# EasyEDA Pro project Selectric Terminal.epro

# Schematic Schematic1
Create Date: 2024-04-24; Page Name: P1; Project Name: Selectric Conversion; Schematic Name: Schematic1; Update Date: 2024-07-01; Company: EasyEDA.com; Drawn: EasyEDA; Page Size: A4; Part Number: JLCPCB-002; Reviewed: EasyEDA; Version: V0.1
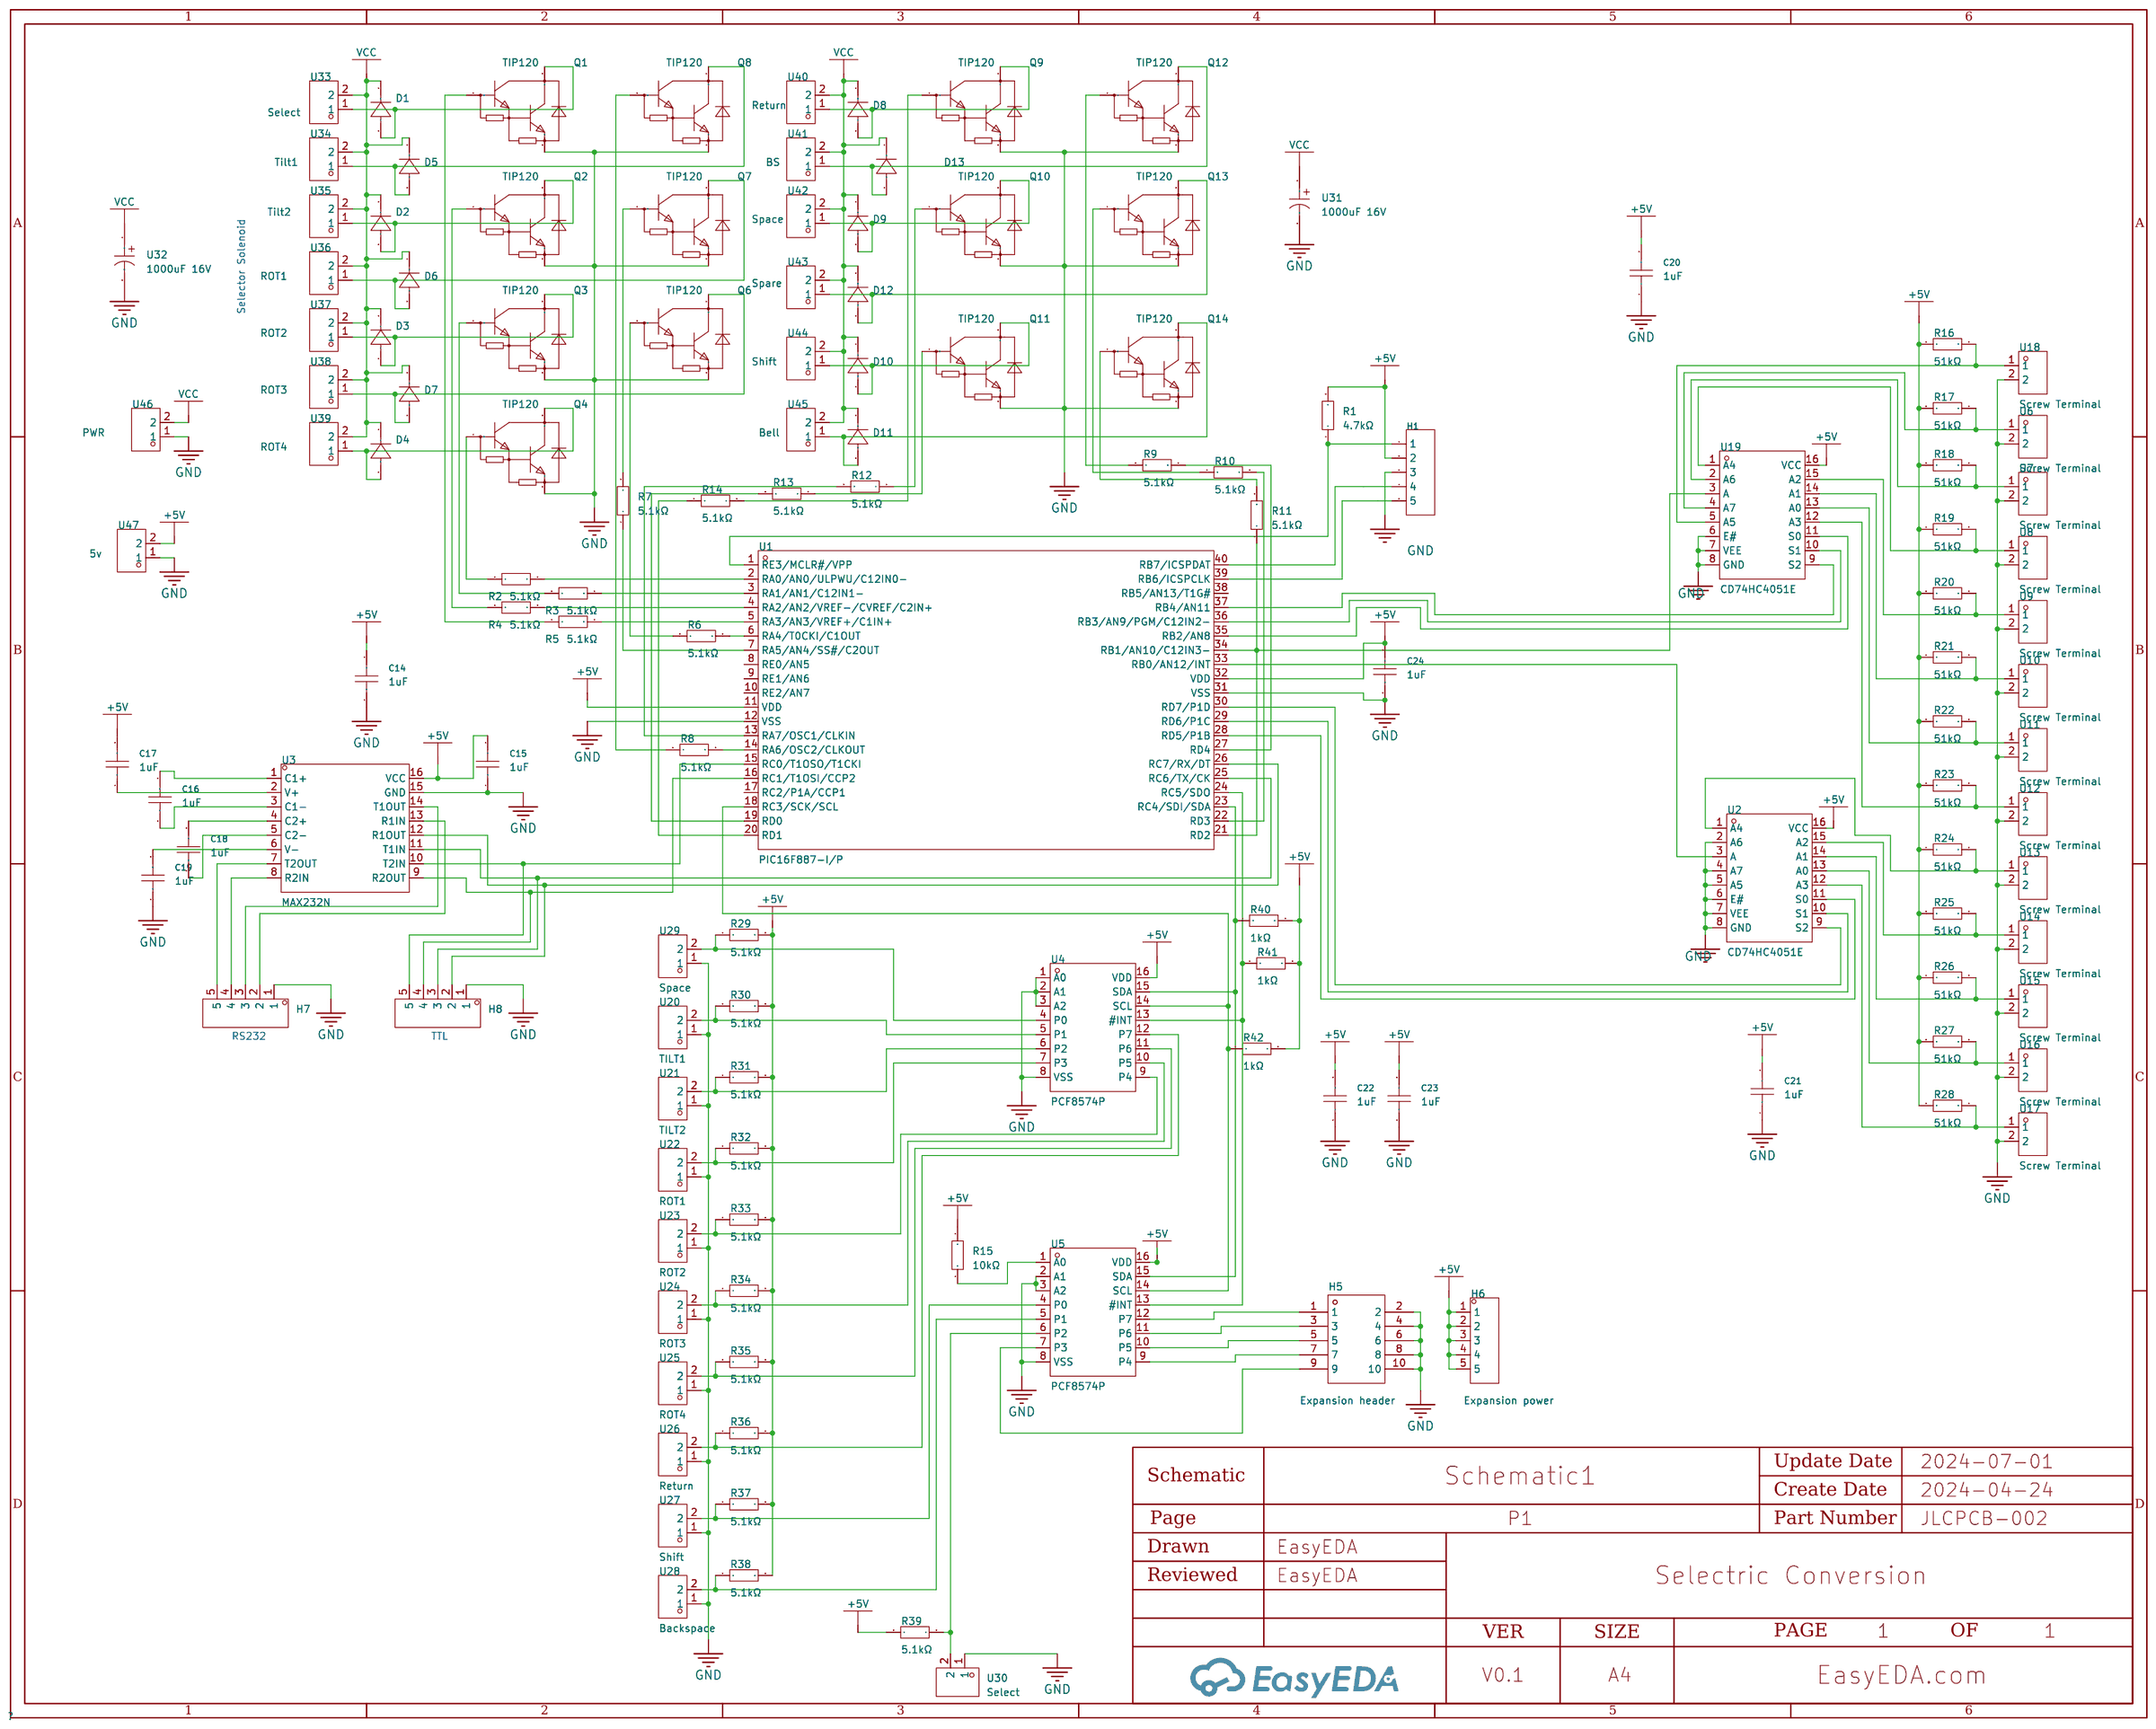
[diagram p0: schematic sheet]

## Parts
C14  1uF  [CAP-TH_L5.0-W2.5-P5.00-D1.0]
C15  1uF  [CAP-TH_L5.0-W2.5-P5.00-D1.0]
C16  1uF  [CAP-TH_L5.0-W2.5-P5.00-D1.0]
C17  1uF  [CAP-TH_L5.0-W2.5-P5.00-D1.0]
C18  1uF  [CAP-TH_L5.0-W2.5-P5.00-D1.0]
C19  1uF  [CAP-TH_L5.0-W2.5-P5.00-D1.0]
C20  1uF  [CAP-TH_L5.0-W2.5-P5.00-D1.0]
C21  1uF  [CAP-TH_L5.0-W2.5-P5.00-D1.0]
C22  1uF  [CAP-TH_L5.0-W2.5-P5.00-D1.0]
C23  1uF  [CAP-TH_L5.0-W2.5-P5.00-D1.0]
C24  1uF  [CAP-TH_L5.0-W2.5-P5.00-D1.0]
D1  -  [DO-41_BD2.4-L4.7-P8.70-D0.9-RD]
D2  -  [DO-41_BD2.4-L4.7-P8.70-D0.9-RD]
D3  -  [DO-41_BD2.4-L4.7-P8.70-D0.9-RD]
D4  -  [DO-41_BD2.4-L4.7-P8.70-D0.9-RD]
D5  -  [DO-41_BD2.4-L4.7-P8.70-D0.9-RD]
D6  -  [DO-41_BD2.4-L4.7-P8.70-D0.9-RD]
D7  -  [DO-41_BD2.4-L4.7-P8.70-D0.9-RD]
D8  -  [DO-41_BD2.4-L4.7-P8.70-D0.9-RD]
D9  -  [DO-41_BD2.4-L4.7-P8.70-D0.9-RD]
D10  -  [DO-41_BD2.4-L4.7-P8.70-D0.9-RD]
D11  -  [DO-41_BD2.4-L4.7-P8.70-D0.9-RD]
D12  -  [DO-41_BD2.4-L4.7-P8.70-D0.9-RD]
D13  -  [DO-41_BD2.4-L4.7-P8.70-D0.9-RD]
H1  -  [HDR-TH_5P-P2.54-V-F]
H5  Expansion header  [HDR-TH_10P-P2.54-V-M-R2-C5-S2.54]
H6  Expansion power  [HDR-TH_5P-P2.54-V-M]
H7  -  [HDR-TH_5P-P2.54-V-M]
H8  -  [HDR-TH_5P-P2.54-V-M]
Q1  TIP120  [TO-220-3_L10.0-W4.5-P2.54-L]
Q2  TIP120  [TO-220-3_L10.0-W4.5-P2.54-L]
Q3  TIP120  [TO-220-3_L10.0-W4.5-P2.54-L]
Q4  TIP120  [TO-220-3_L10.0-W4.5-P2.54-L]
Q6  TIP120  [TO-220-3_L10.0-W4.5-P2.54-L]
Q7  TIP120  [TO-220-3_L10.0-W4.5-P2.54-L]
Q8  TIP120  [TO-220-3_L10.0-W4.5-P2.54-L]
Q9  TIP120  [TO-220-3_L10.0-W4.5-P2.54-L]
Q10  TIP120  [TO-220-3_L10.0-W4.5-P2.54-L]
Q11  TIP120  [TO-220-3_L10.0-W4.5-P2.54-L]
Q12  TIP120  [TO-220-3_L10.0-W4.5-P2.54-L]
Q13  TIP120  [TO-220-3_L10.0-W4.5-P2.54-L]
Q14  TIP120  [TO-220-3_L10.0-W4.5-P2.54-L]
R1  4.7kΩ  [R_AXIAL-0.4]
R2  5.1kΩ  [R_AXIAL-0.4]
R3  5.1kΩ  [R_AXIAL-0.4]
R4  5.1kΩ  [R_AXIAL-0.4]
R5  5.1kΩ  [R_AXIAL-0.4]
R6  5.1kΩ  [R_AXIAL-0.4]
R7  5.1kΩ  [R_AXIAL-0.4]
R8  5.1kΩ  [R_AXIAL-0.4]
R9  5.1kΩ  [R_AXIAL-0.4]
R10  5.1kΩ  [R_AXIAL-0.4]
R11  5.1kΩ  [R_AXIAL-0.4]
R12  5.1kΩ  [R_AXIAL-0.4]
R13  5.1kΩ  [R_AXIAL-0.4]
R14  5.1kΩ  [R_AXIAL-0.4]
R15  10kΩ  [R_AXIAL-0.4]
R16  51kΩ  [R_AXIAL-0.4]
R17  51kΩ  [R_AXIAL-0.4]
R18  51kΩ  [R_AXIAL-0.4]
R19  51kΩ  [R_AXIAL-0.4]
R20  51kΩ  [R_AXIAL-0.4]
R21  51kΩ  [R_AXIAL-0.4]
R22  51kΩ  [R_AXIAL-0.4]
R23  51kΩ  [R_AXIAL-0.4]
R24  51kΩ  [R_AXIAL-0.4]
R25  51kΩ  [R_AXIAL-0.4]
R26  51kΩ  [R_AXIAL-0.4]
R27  51kΩ  [R_AXIAL-0.4]
R28  51kΩ  [R_AXIAL-0.4]
R29  5.1kΩ  [R_AXIAL-0.4]
R30  5.1kΩ  [R_AXIAL-0.4]
R31  5.1kΩ  [R_AXIAL-0.4]
R32  5.1kΩ  [R_AXIAL-0.4]
R33  5.1kΩ  [R_AXIAL-0.4]
R34  5.1kΩ  [R_AXIAL-0.4]
R35  5.1kΩ  [R_AXIAL-0.4]
R36  5.1kΩ  [R_AXIAL-0.4]
R37  5.1kΩ  [R_AXIAL-0.4]
R38  5.1kΩ  [R_AXIAL-0.4]
R39  5.1kΩ  [R_AXIAL-0.4]
R40  1kΩ  [R_AXIAL-0.4]
R41  1kΩ  [R_AXIAL-0.4]
R42  1kΩ  [R_AXIAL-0.4]
U1  PIC16F887-I/P  [PDIP-40_L52.3-W13.7-P2.54-LS15.5-BL]
U2  CD74HC4051E  [DIP-16_L20.0-W6.4-P2.54-LS7.6-BL]
U3  MAX232N  [PDIP-16_L19.7-W6.6-P2.54-LS7.8-BL]
U4  PCF8574P  [DIP-16_L19.3-W6.4-P2.54-LS7.6-BL]
U5  PCF8574P  [DIP-16_L19.3-W6.4-P2.54-LS7.6-BL]
U6  Screw Terminal  [CONN-TH_2P-P5.00_DB128V-5.0-2P]
U7  Screw Terminal  [CONN-TH_2P-P5.00_DB128V-5.0-2P]
U8  Screw Terminal  [CONN-TH_2P-P5.00_DB128V-5.0-2P]
U9  Screw Terminal  [CONN-TH_2P-P5.00_DB128V-5.0-2P]
U10  Screw Terminal  [CONN-TH_2P-P5.00_DB128V-5.0-2P]
U11  Screw Terminal  [CONN-TH_2P-P5.00_DB128V-5.0-2P]
U12  Screw Terminal  [CONN-TH_2P-P5.00_DB128V-5.0-2P]
U13  Screw Terminal  [CONN-TH_2P-P5.00_DB128V-5.0-2P]
U14  Screw Terminal  [CONN-TH_2P-P5.00_DB128V-5.0-2P]
U15  Screw Terminal  [CONN-TH_2P-P5.00_DB128V-5.0-2P]
U16  Screw Terminal  [CONN-TH_2P-P5.00_DB128V-5.0-2P]
U17  Screw Terminal  [CONN-TH_2P-P5.00_DB128V-5.0-2P]
U18  Screw Terminal  [CONN-TH_2P-P5.00_DB128V-5.0-2P]
U19  CD74HC4051E  [DIP-16_L20.0-W6.4-P2.54-LS7.6-BL]
U20  TILT1  [CONN-TH_2P-P5.00_DB128V-5.0-2P]
U21  TILT2  [CONN-TH_2P-P5.00_DB128V-5.0-2P]
U22  ROT1  [CONN-TH_2P-P5.00_DB128V-5.0-2P]
U23  ROT2  [CONN-TH_2P-P5.00_DB128V-5.0-2P]
U24  ROT3  [CONN-TH_2P-P5.00_DB128V-5.0-2P]
U25  ROT4  [CONN-TH_2P-P5.00_DB128V-5.0-2P]
U26  Return  [CONN-TH_2P-P5.00_DB128V-5.0-2P]
U27  Shift  [CONN-TH_2P-P5.00_DB128V-5.0-2P]
U28  Backspace  [CONN-TH_2P-P5.00_DB128V-5.0-2P]
U29  Space  [CONN-TH_2P-P5.00_DB128V-5.0-2P]
U30  Select  [CONN-TH_2P-P5.00_DB128V-5.0-2P]
U31  1000uF 16V  [CAP-TH_BD10.0-P5.00-D0.6-FD]
U32  1000uF 16V  [CAP-TH_BD10.0-P5.00-D0.6-FD]
U33  Select  [CONN-TH_2P-P5.00_DB128V-5.0-2P]
U34  Tilt1  [CONN-TH_2P-P5.00_DB128V-5.0-2P]
U35  Tilt2  [CONN-TH_2P-P5.00_DB128V-5.0-2P]
U36  ROT1  [CONN-TH_2P-P5.00_DB128V-5.0-2P]
U37  ROT2  [CONN-TH_2P-P5.00_DB128V-5.0-2P]
U38  ROT3  [CONN-TH_2P-P5.00_DB128V-5.0-2P]
U39  ROT4  [CONN-TH_2P-P5.00_DB128V-5.0-2P]
U40  Return  [CONN-TH_2P-P5.00_DB128V-5.0-2P]
U41  BS  [CONN-TH_2P-P5.00_DB128V-5.0-2P]
U42  Space  [CONN-TH_2P-P5.00_DB128V-5.0-2P]
U43  Spare  [CONN-TH_2P-P5.00_DB128V-5.0-2P]
U44  Shift  [CONN-TH_2P-P5.00_DB128V-5.0-2P]
U45  Bell  [CONN-TH_2P-P5.00_DB128V-5.0-2P]
U46  PWR  [CONN-TH_2P-P5.00_DB128V-5.0-2P]
U47  5v  [CONN-TH_2P-P5.00_DB128V-5.0-2P]

## Library data of the parts
C14-C24 = CC1H104MC1FD3F6C10MF: Capacitance:100nF Tolerance:±20% Tolerance:±20% Voltage Rated: Lead Spacing: Temperature Coefficient: φD: Body Thickness:; LCSC Part Name: 100nF ±20% 50V; Supplier Part: C254085; Manufacturer: Dersonic(德尔创); Supplier Footprint: 插件,P=5.08mm; JLCPCB Part Class: Extended Part; Datasheet: https://atta.szlcsc.com/upload/public/pdf/source/20200826/C254085_159DD65BF32BF11C9168D341BCE23E6F.pdf; Supplier: LCSC; Tolerance: ±20%
D1-D13 = 1N4007: Supplier Footprint: DO-41
H1 = HDR-F_2.54_1x5P: Supplier Footprint: Through
H5 = HDR-M_2.54_2x5: Supplier Footprint: Through
H6-H8 = HDR-M_2.54_1x5P: Supplier Footprint: Through
Q1-Q4 Q6-Q14 = TIP120_C262990: Transistor Type:NPN Collector-emitter voltage (Vceo):60V DC current gain (hFE@Vce,Ic):1000@3V,3A DC current gain (hFE@Vce,Ic):1000@3V,3A Power Dissipation (Pd):2W Collector Current (Ic):5A Transition frequency (fT):- Collector cut-off current (Icbo@Vcb):5; LCSC Part Name: NPN 耐压:60V 电流:5A; Supplier Part: C262990; Manufacturer: ST(意法半导体); Supplier Footprint: TO-220; JLCPCB Part Class: Extended Part; Datasheet: https://atta.szlcsc.com/upload/public/pdf/source/20180806/C262990_0EE67BD9C596AF827C63E15CA7C78F26.pdf; Supplier: LCSC; Transistor Type: NPN; Collector-emitter voltage (Vceo): 60V; DC current gain (hFE@Vce,Ic): 1000@3V,3A; Power Dissipation (Pd): 2W; Collector Current (Ic): 5A; Collector cut-off current (Icbo@Vcb): 500uA; Collector-emitter saturation voltage (VCE(sat)@Ic,Ib): 4V@5A,20mA
R1-R42 = Res_AXIAL-1/4W: Supplier Footprint: Through
U1 = PIC16F887-I/P: CPU Core:PIC Program Storage Size:14KB GPIO Ports Number:35 Operating Voltage Range:2V~5.5V Operating Voltage Range:2V~5.5V CPU Maximum Speed:20MHz Operating Temperature Range:-40℃~+85℃ Operating Temperature Range:-40℃~+85℃ ADC (Bit):10bit Watchdog:有 Low-; Supplier Part: C1337531; Manufacturer: MICROCHIP(美国微芯); Supplier Footprint: PDIP-40; JLCPCB Part Class: Extended Part; Datasheet: https://atta.szlcsc.com/upload/public/pdf/source/20180719/C220671_CD532A65A2F6F6B445C7E976F94E0D97.pdf; Supplier: LCSC; CPU Core: PIC; Program Storage Size: 14KB; GPIO Ports Number: 35; Operating Voltage Range: 2V~5.5V; CPU Maximum Speed: 20MHz; Operating Temperature Range: -40℃~+85℃; ADC (Bit): 10bit; Watchdog: 有; Low-Voltage Detect: 有; Internal Oscillator: 有
U2 U19 = CD74HC4051E: Number of Channels:1 Supply Voltage:2V~6V Supply Voltage:2V~6V On-State Resistance (Max):130Ω; Supplier Part: C205976; Manufacturer: TI(德州仪器); Supplier Footprint: PDIP-16; JLCPCB Part Class: Extended Part; Datasheet: https://www.ti.com/cn/lit/gpn/cd74hc4051; Supplier: LCSC; Number of Channels: 1; Supply Voltage: 2V~6V; On-State Resistance (Max): 130Ω
U3 = MAX232N: Types:transceiver Driver/receiver:2/2 Data Rate:120Kbps Data Rate:120Kbps Supply Voltage:4.5V~5.5V Supply Voltage:4.5V~5.5V Operating Temperature:0℃~+70℃ Operating Temperature:0℃~+70℃; Supplier Part: C353147; Manufacturer: TI(德州仪器); Supplier Footprint: PDIP-16; JLCPCB Part Class: Extended Part; Datasheet: https://www.ti.com/cn/lit/gpn/max232; Supplier: LCSC; Types: transceiver; Driver/receiver: 2/2; Data Rate: 120Kbps; Supply Voltage: 4.5V~5.5V; Operating Temperature: 0℃~+70℃
U4 U5 = PCF8574P: Interface:I2C Number of I/O:8 Interrupt Output:有中断输出 Output Type: Supply Voltage:2.5V~6V Supply Voltage:2.5V~6V Output Source current:300uA Output Sink Current:25mA Clock Frequency:100kHz Operating Temperature:-40℃~+85℃ Operating Temperature:-40℃~+85℃; LCSC Part Name: I2C总线 远程8位I/O扩展; Supplier Part: C398073; Manufacturer: HGSEMI(华冠); Supplier Footprint: DIP-16; JLCPCB Part Class: Extended Part; Datasheet: https://atta.szlcsc.com/upload/public/pdf/source/20190611/C398075_1925312D8618E19C6137781D5B71A3CA.pdf; Supplier: LCSC; Interface: I2C; Number of I/O: 8; Interrupt Output: 有中断输出; Supply Voltage: 2.5V~6V; Output Source current: 300uA; Output Sink Current: 25mA; Clock Frequency: 100kHz; Operating Temperature: -40℃~+85℃
U6-U18 U20-U30 U33-U47 = DB128V-5.0-2P-GN-S: Structure:1x2P Pitch:5mm Color:Green Mounting Style:Straight Current Rating (Max):20A Voltage Rating (Max):300V Number of Pins:2P Number of Rows:1 Wire Gauge - AWG:12~30 Wire Gauge - AWG:12~30 Wire Gauge - mm2:2.5 Wire Gauge - mm2:2.5 Number of PINs Per R; LCSC Part Name: 5mm 1x2P 排数:1 每排P数:2 直插; Supplier Part: C395860; Manufacturer: DORABO(地博电气); Supplier Footprint: 插件,P=5mm; JLCPCB Part Class: Extended Part; Datasheet: https://atta.szlcsc.com/upload/public/pdf/source/20230106/1C26AF647DE84A253DB7E5AA54EB19EE.pdf; Supplier: LCSC; Structure: 1x2P; Pitch: 5mm; Color: Green; Mounting Style: Straight; Current Rating (Max): 20A; Voltage Rating (Max): 300V; Number of Pins: 2P; Number of Rows: 1; Wire Gauge - AWG: 12~30; Wire Gauge - mm2: 2.5; Number of PINs Per Row: 2; Operating Temperature Range: -40℃~+105℃
U31 U32 = 1000uF 16V: Supplier Part: C439782; Manufacturer: CX(承兴); Supplier Footprint: 插件,D10xL13mm; JLCPCB Part Class: Extended Part; Supplier: LCSC

## Nets
+5V: C14.2 C15.2 C17.2 C20.2 C21.2 C22.2 C23.2 C24.2 H1.2 H6.1 H6.2 H6.3 H6.4 H6.5 R1.2 R15.2 R16.1 R17.1 R18.1 R19.1 R20.1 R21.1 R22.1 R23.1 R24.1 R25.1 R26.1 R27.1 R28.1 R29.2 R30.2 R31.2 R32.2 R33.2 R34.2 R35.2 R36.2 R37.2 R38.2 R39.1 R40.2 R41.2 R42.2 U1.11(VDD) U1.32(VDD) U2.16(VCC) U3.16(VCC) U4.16(VDD) U5.16(VDD) U19.16(VCC) U47.2
GND: C14.1 C15.1 C19.1 C20.1 C21.1 C22.1 C23.1 C24.1 H1.3 H5.2 H5.4 H5.6 H5.8 H5.10 H7.1 H8.1 Q1.3(E) Q2.3(E) Q3.3(E) Q4.3(E) Q6.3(E) Q7.3(E) Q8.3(E) Q9.3(E) Q10.3(E) Q11.3(E) Q12.3(E) Q13.3(E) Q14.3(E) U1.12(VSS) U1.31(VSS) U2.2(A6) U2.4(A7) U2.5(A5) U2.6(E#) U2.7(VEE) U2.8(GND) U3.15(GND) U4.1(A0) U4.2(A1) U4.3(A2) U4.8(VSS) U5.2(A1) U5.3(A2) U5.8(VSS) U6.2 U7.2 U8.2 U9.2 U10.2 U11.2 U12.2 U13.2 U14.2 U15.2 U16.2 U17.2 U18.2 U19.6(E#) U19.7(VEE) U19.8(GND) U20.1 U21.1 U22.1 U23.1 U24.1 U25.1 U26.1 U27.1 U28.1 U29.1 U30.1 U31.2 U32.2 U46.1 U47.1
VCC: D1.1(K) D2.1(K) D3.1(K) D4.1(K) D5.1(K) D6.1(K) D7.1(K) D8.1(K) D9.1(K) D10.1(K) D11.1(K) D12.1(K) D13.1(K) U31.1 U32.1 U33.2 U34.2 U35.2 U36.2 U37.2 U38.2 U39.2 U40.2 U41.2 U42.2 U43.2 U44.2 U45.2 U46.2
$1N2074: U1.33(RB0/AN12/INT) U2.3(A)
$1N3237: C16.2 U3.1(C1+)
$1N3246: C16.1 U3.3(C1-)
$1N3251: C18.2 U3.4(C2+)
$1N3254: C18.1 U3.5(C2-)
$1N3731: D1.2(A) Q1.2(C) U33.1
$1N3765: D2.2(A) Q2.2(C) U35.1
$1N3801: D3.2(A) Q3.2(C) U37.1
$1N3842: D4.2(A) Q4.2(C) U39.1
$1N3888: D5.2(A) Q8.2(C) U34.1
$1N3934: D6.2(A) Q7.2(C) U36.1
$1N3992: D7.2(A) Q6.2(C) U38.1
$1N4173: D8.2(A) Q9.2(C) U40.1
$1N4211: D13.2(A) Q12.2(C) U41.1
$1N4247: D9.2(A) Q10.2(C) U42.1
$1N4285: D12.2(A) Q13.2(C) U43.1
$1N4325: D10.2(A) Q11.2(C) U44.1
$1N4367: D11.2(A) Q14.2(C) U45.1
$1N5558: H1.1 R1.1 U1.1(RE3/MCLR#/VPP)
$1N5572: H1.4 U1.40(RB7/ICSPDAT)
$1N5582: H1.5 U1.39(RB6/ICSPCLK)
$1N6750: C19.2 U3.6(V-)
$1N6798: C17.1 U3.2(V+)
$1N7931: H8.2 U1.26(RC7/RX/DT) U3.12(R1OUT)
$1N7983: H8.3 U1.25(RC6/TX/CK) U3.11(T1IN)
$1N8002: H8.4 U1.16(RC1/T1OSI/CCP2) U3.9(R2OUT)
$1N8069: H8.5 U1.15(RC0/T1OSO/T1CKI) U3.10(T2IN)
$1N8133: H7.3 U3.14(T1OUT)
$1N8212: H7.2 U3.13(R1IN)
$1N8218: H7.4 U3.8(R2IN)
$1N8222: H7.5 U3.7(T2OUT)
$1N13570: Q4.1(B) R2.1
$1N13571: R2.2 U1.2(RA0/AN0/ULPWU/C12IN0-)
$1N13601: Q3.1(B) R3.1
$1N13602: R3.2 U1.3(RA1/AN1/C12IN1-)
$1N13633: Q2.1(B) R4.1
$1N13634: R4.2 U1.4(RA2/AN2/VREF-/CVREF/C2IN+)
$1N13665: Q1.1(B) R5.1
$1N13666: R5.2 U1.5(RA3/AN3/VREF+/C1IN+)
$1N13721: Q6.1(B) R6.1
$1N13722: R6.2 U1.6(RA4/T0CKI/C1OUT)
$1N13752: Q7.1(B) R7.2
$1N13753: R7.1 U1.7(RA5/AN4/SS#/C2OUT)
$1N13784: Q8.1(B) R8.1
$1N13785: R8.2 U1.14(RA6/OSC2/CLKOUT)
$1N13840: Q12.1(B) R9.1
$1N13841: R9.2 U1.27(RD4)
$1N13874: Q13.1(B) R10.1
$1N13875: R10.2 U1.22(RD3)
$1N13908: Q14.1(B) R11.2
$1N13941: Q10.1(B) R12.1
$1N13942: R12.2 U1.13(RA7/OSC1/CLKIN)
$1N13975: Q11.1(B) R13.1
$1N13976: R13.2 U1.19(RD0)
$1N14008: Q9.1(B) R14.1
$1N14009: R14.2 U1.20(RD1)
$1N14186: R40.1 U1.23(RC4/SDI/SDA) U4.15(SDA) U5.15(SDA)
$1N14193: R42.1 U1.18(RC3/SCK/SCL) U4.14(SCL) U5.14(SCL)
$1N14202: R41.1 U1.24(RC5/SDO) U4.13(#INT) U5.13(#INT)
$1N14385: R15.1 U5.1(A0)
$1N16045: R11.1 U1.21(RD2) U1.34(RB1/AN10/C12IN3-) U19.3(A)
$1N16121: U1.35(RB2/AN8) U19.11(S0)
$1N16130: U1.36(RB3/AN9/PGM/C12IN2-) U19.10(S1)
$1N16148: U1.37(RB4/AN11) U19.9(S2)
$1N16157: U1.28(RD5/P1B) U2.11(S0)
$1N16164: U1.29(RD6/P1C) U2.10(S1)
$1N16178: U1.30(RD7/P1D) U2.9(S2)
$1N17408: H5.1 U5.12(P7)
$1N17413: H5.3 U5.11(P6)
$1N17418: H5.5 U5.10(P5)
$1N17423: H5.7 U5.9(P4)
$1N17428: H5.9 U5.7(P3)
$1N17969: R29.1 U4.4(P0) U29.2
$1N17976: R30.1 U4.5(P1) U20.2
$1N17983: R31.1 U4.6(P2) U21.2
$1N17990: R32.1 U4.7(P3) U22.2
$1N17997: R33.1 U4.9(P4) U23.2
$1N18006: R34.1 U4.10(P5) U24.2
$1N18015: R35.1 U4.11(P6) U25.2
$1N18024: R36.1 U4.12(P7) U26.2
$1N18172: R37.1 U5.4(P0) U27.2
$1N18208: R38.1 U5.5(P1) U28.2
$1N18215: R39.2 U5.6(P2) U30.2
$1N20388: R28.2 U2.12(A3) U17.1
$1N20399: R27.2 U2.13(A0) U16.1
$1N20410: R26.2 U2.14(A1) U15.1
$1N20421: R25.2 U2.15(A2) U14.1
$1N20432: R24.2 U2.1(A4) U13.1
$1N20451: R23.2 U12.1 U19.12(A3)
$1N20462: R22.2 U11.1 U19.13(A0)
$1N20473: R21.2 U10.1 U19.14(A1)
$1N20484: R20.2 U9.1 U19.15(A2)
$1N20503: R19.2 U8.1 U19.1(A4)
$1N20518: R18.2 U7.1 U19.2(A6)
$1N20533: R17.2 U6.1 U19.4(A7)
$1N20548: R16.2 U18.1 U19.5(A5)

Not connected (* = marked no-connect by the designer): U1 8(RE0/AN5) 9(RE1/AN6) 10(RE2/AN7) 17(RC2/P1A/CCP1) 38(RB5/AN13/T1G#)

## Notes on the sheet
- Selector Solenoid
- RS232
- TTL

# Board PCB1
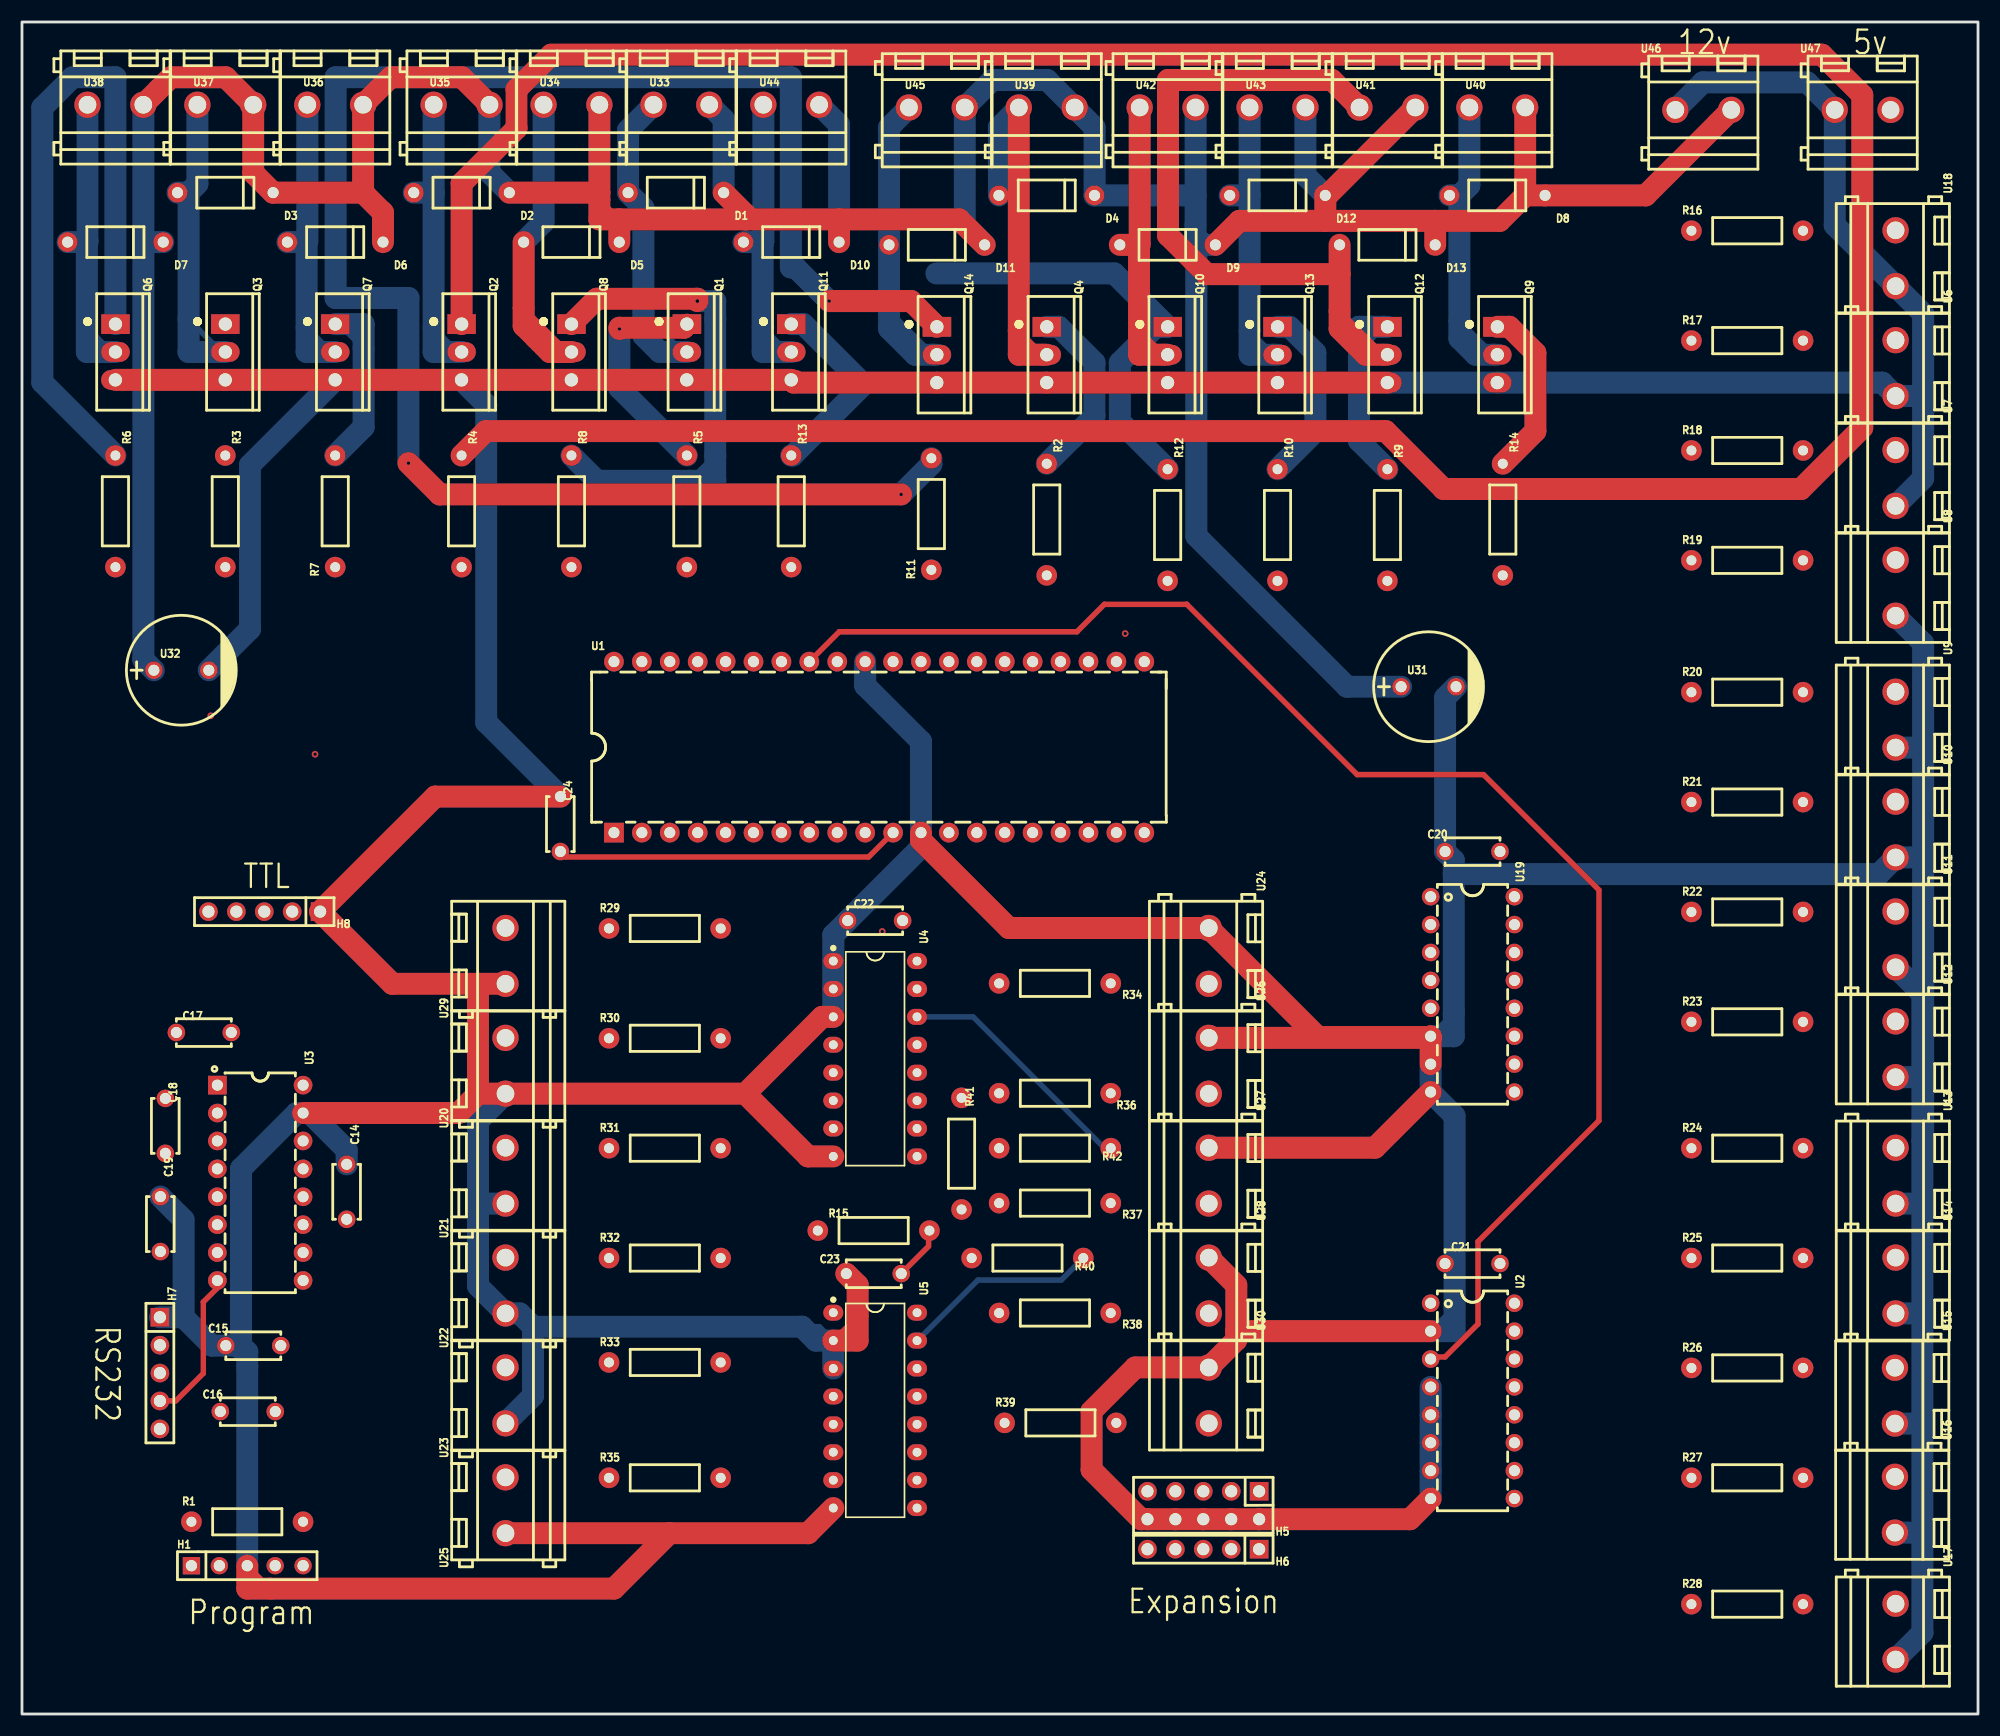
[diagram p1: board, top side]
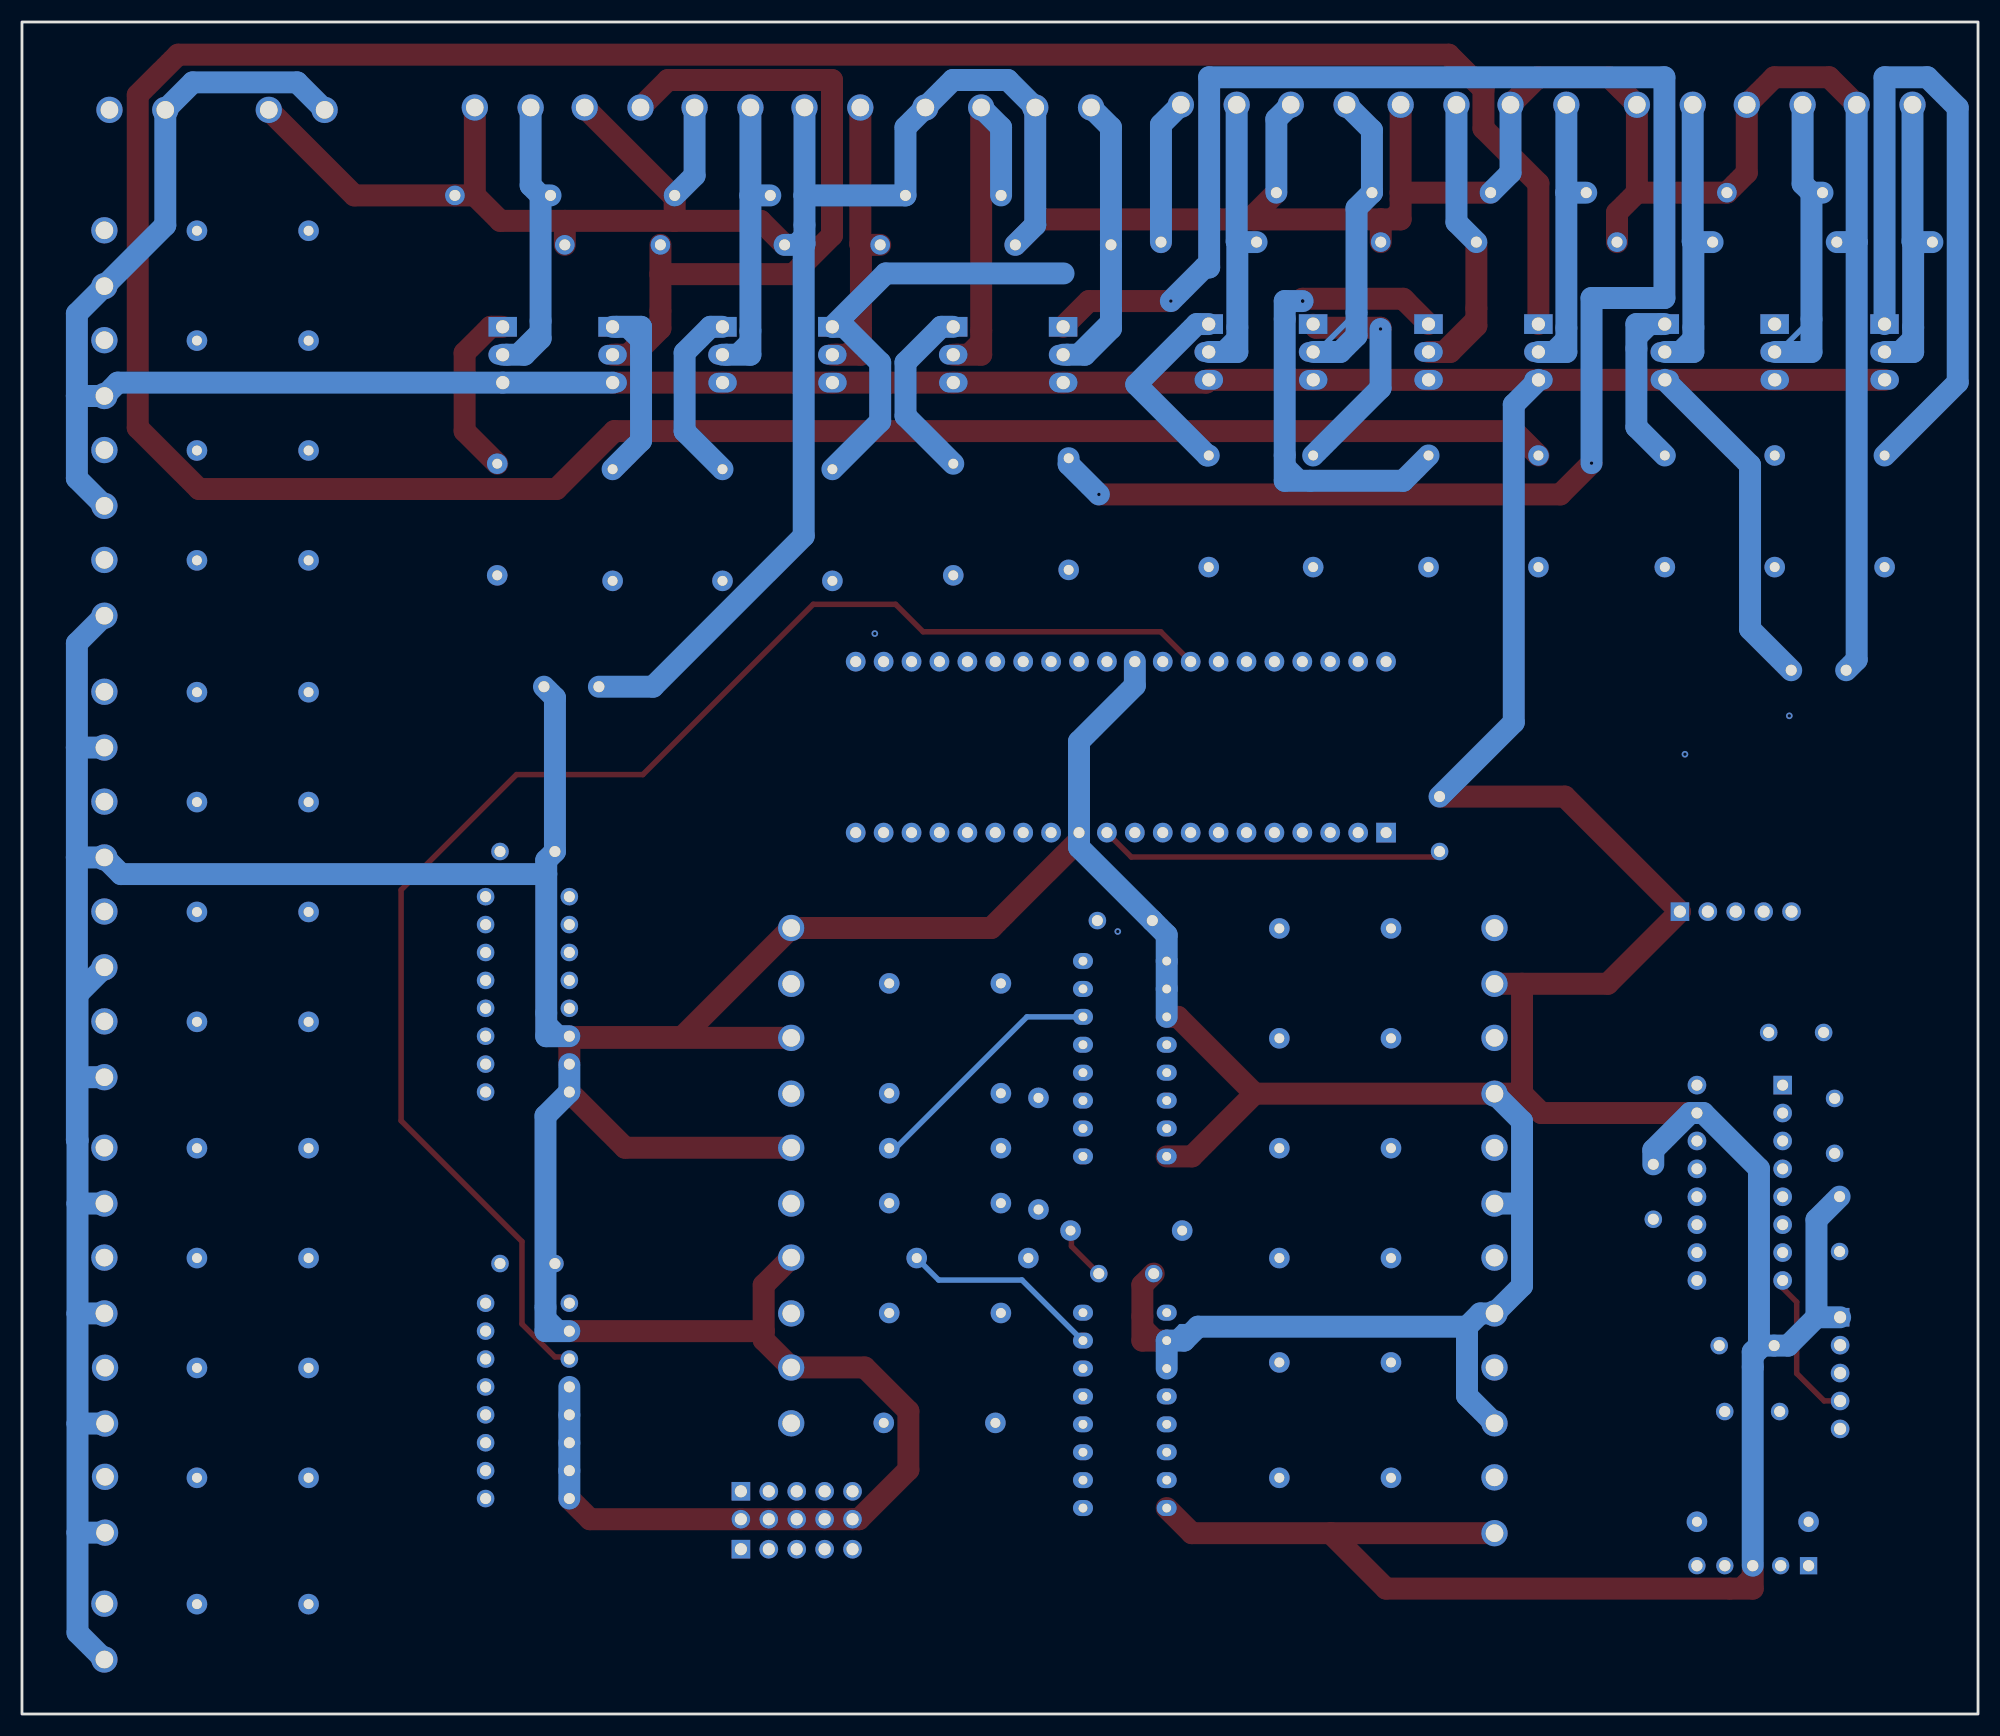
[diagram p2: board, bottom side, seen from below]

Outline 178 x 154 mm; copper layers: Top Layer, Inner1, Inner2, Bottom Layer. Coordinates in mm from the lower left corner of the outline.
Outline path: rectangle 0,154 178,0
Stack: Top Layer 0.035mm 外层铜厚1oz / Dielectric1 0.2104mm 7628 RC49% 8.6mil / Inner1 0.0152mm 内层铜厚 / Dielectric2 1.065mm 1.1mm H/HOZ 含铜 / Inner2 0.0152mm 内层铜厚 / Dielectric3 0.2104mm 7628 RC49% 8.6mil / Bottom Layer 0.035mm 外层铜厚1oz

## Design rules (mm)
template: Custom Config
spacing copperThickness1oz (default): track to track 0.152, other pairs 0.152 to 0.3
spacing copperThickness2oz: track to track 0.203, other pairs 0.152 to 0.3
track width copperThickness1oz (default): min 0.127, default 0.5, max 2.54
track width copperThickness2oz: min 0.203, default 0.254, max 2.54
differential pair differentialPair (default): width min 0.127, default 0.254, max 2.54; gap min 0.152, default 0.152
via viaSize (default): diameter min 0.5, default 0.61, max 10; hole min 0.3, default 0.305, max 6.3

## Placement (name value [footprint] x y rotation side)
C14  1uF  [CAP-TH_L5.0-W2.5-P5.00-D1.0]  29.55 47.53 270 top
C15  1uF  [CAP-TH_L5.0-W2.5-P5.00-D1.0]  21.05 33.53 0 top
C16  1uF  [CAP-TH_L5.0-W2.5-P5.00-D1.0]  20.55 27.53 0 top
C17  1uF  [CAP-TH_L5.0-W2.5-P5.00-D1.0]  16.55 62.03 0 top
C18  1uF  [CAP-TH_L5.0-W2.5-P5.00-D1.0]  13.05 53.53 270 top
C19  1uF  [CAP-TH_L5.0-W2.5-P5.00-D1.0]  12.6 44.59 270 top
C20  1uF  [CAP-TH_L5.0-W2.5-P5.00-D1.0]  132 78.5 0 top
C21  1uF  [CAP-TH_L5.0-W2.5-P5.00-D1.0]  132 41 0 top
C22  1uF  [CAP-TH_L5.0-W2.5-P5.00-D1.0]  77.64 72.21 0 top
C23  1uF  [CAP-TH_L5.0-W2.5-P5.00-D1.0]  77.51 40.08 0 top
C24  1uF  [CAP-TH_L5.0-W2.5-P5.00-D1.0]  49 81 270 top
D1  -  [DO-41_BD2.4-L4.7-P8.70-D0.9-RD]  59.5 138.47 180 top
D2  -  [DO-41_BD2.4-L4.7-P8.70-D0.9-RD]  40 138.47 180 top
D3  -  [DO-41_BD2.4-L4.7-P8.70-D0.9-RD]  18.5 138.47 180 top
D4  -  [DO-41_BD2.4-L4.7-P8.70-D0.9-RD]  93.25 138.22 180 top
D5  -  [DO-41_BD2.4-L4.7-P8.70-D0.9-RD]  50 133.97 180 top
D6  -  [DO-41_BD2.4-L4.7-P8.70-D0.9-RD]  28.5 133.97 180 top
D7  -  [DO-41_BD2.4-L4.7-P8.70-D0.9-RD]  8.5 133.97 180 top
D8  -  [DO-41_BD2.4-L4.7-P8.70-D0.9-RD]  134.25 138.22 180 top
D9  -  [DO-41_BD2.4-L4.7-P8.70-D0.9-RD]  104.25 133.72 180 top
D10  -  [DO-41_BD2.4-L4.7-P8.70-D0.9-RD]  70 133.97 180 top
D11  -  [DO-41_BD2.4-L4.7-P8.70-D0.9-RD]  83.25 133.72 180 top
D12  -  [DO-41_BD2.4-L4.7-P8.70-D0.9-RD]  114.25 138.22 180 top
D13  -  [DO-41_BD2.4-L4.7-P8.70-D0.9-RD]  124.25 133.72 180 top
H1  -  [HDR-TH_5P-P2.54-V-F]  20.5 13.5 0 top
H5  Expansion header  [HDR-TH_10P-P2.54-V-M-R2-C5-S2.54]  107.5 19 180 top
H6  Expansion power  [HDR-TH_5P-P2.54-V-M]  107.5 15 180 top
H7  -  [HDR-TH_5P-P2.54-V-M]  12.55 31.03 270 top
H8  -  [HDR-TH_5P-P2.54-V-M]  22.05 73.03 180 top
Q1  TIP120  [TO-220-3_L10.0-W4.5-P2.54-L]  60.5 123.97 270 top
Q2  TIP120  [TO-220-3_L10.0-W4.5-P2.54-L]  40 123.97 270 top
Q3  TIP120  [TO-220-3_L10.0-W4.5-P2.54-L]  18.5 123.97 270 top
Q4  TIP120  [TO-220-3_L10.0-W4.5-P2.54-L]  93.25 123.72 270 top
Q6  TIP120  [TO-220-3_L10.0-W4.5-P2.54-L]  8.5 123.97 270 top
Q7  TIP120  [TO-220-3_L10.0-W4.5-P2.54-L]  28.5 123.97 270 top
Q8  TIP120  [TO-220-3_L10.0-W4.5-P2.54-L]  50 123.97 270 top
Q9  TIP120  [TO-220-3_L10.0-W4.5-P2.54-L]  134.25 123.72 270 top
Q10  TIP120  [TO-220-3_L10.0-W4.5-P2.54-L]  104.25 123.72 270 top
Q11  TIP120  [TO-220-3_L10.0-W4.5-P2.54-L]  70 123.97 270 top
Q12  TIP120  [TO-220-3_L10.0-W4.5-P2.54-L]  124.25 123.72 270 top
Q13  TIP120  [TO-220-3_L10.0-W4.5-P2.54-L]  114.25 123.72 270 top
Q14  TIP120  [TO-220-3_L10.0-W4.5-P2.54-L]  83.25 123.72 270 top
R1  4.7kΩ  [R_AXIAL-0.4]  20.5 17.5 0 top
R2  5.1kΩ  [R_AXIAL-0.4]  93.25 108.72 270 top
R3  5.1kΩ  [R_AXIAL-0.4]  18.5 109.47 270 top
R4  5.1kΩ  [R_AXIAL-0.4]  40 109.47 270 top
R5  5.1kΩ  [R_AXIAL-0.4]  60.5 109.47 270 top
R6  5.1kΩ  [R_AXIAL-0.4]  8.5 109.47 270 top
R7  5.1kΩ  [R_AXIAL-0.4]  28.5 109.47 90 top
R8  5.1kΩ  [R_AXIAL-0.4]  50 109.47 270 top
R9  5.1kΩ  [R_AXIAL-0.4]  124.25 108.22 270 top
R10  5.1kΩ  [R_AXIAL-0.4]  114.25 108.22 270 top
R11  5.1kΩ  [R_AXIAL-0.4]  82.75 109.22 90 top
R12  5.1kΩ  [R_AXIAL-0.4]  104.25 108.22 270 top
R13  5.1kΩ  [R_AXIAL-0.4]  70 109.47 270 top
R14  5.1kΩ  [R_AXIAL-0.4]  134.75 108.72 270 top
R15  10kΩ  [R_AXIAL-0.4]  77.5 44 0 top
R16  51kΩ  [R_AXIAL-0.4]  157 135 0 top
R17  51kΩ  [R_AXIAL-0.4]  157 125 0 top
R18  51kΩ  [R_AXIAL-0.4]  157 115 0 top
R19  51kΩ  [R_AXIAL-0.4]  157 105 0 top
R20  51kΩ  [R_AXIAL-0.4]  157 93 0 top
R21  51kΩ  [R_AXIAL-0.4]  157 83 0 top
R22  51kΩ  [R_AXIAL-0.4]  157 73 0 top
R23  51kΩ  [R_AXIAL-0.4]  157 63 0 top
R24  51kΩ  [R_AXIAL-0.4]  157 51.5 0 top
R25  51kΩ  [R_AXIAL-0.4]  157 41.5 0 top
R26  51kΩ  [R_AXIAL-0.4]  157 31.5 0 top
R27  51kΩ  [R_AXIAL-0.4]  157 21.5 0 top
R28  51kΩ  [R_AXIAL-0.4]  157 10 0 top
R29  5.1kΩ  [R_AXIAL-0.4]  58.5 71.5 0 top
R30  5.1kΩ  [R_AXIAL-0.4]  58.5 61.5 0 top
R31  5.1kΩ  [R_AXIAL-0.4]  58.5 51.5 0 top
R32  5.1kΩ  [R_AXIAL-0.4]  58.5 41.5 0 top
R33  5.1kΩ  [R_AXIAL-0.4]  58.5 32 0 top
R34  5.1kΩ  [R_AXIAL-0.4]  94 66.5 180 top
R35  5.1kΩ  [R_AXIAL-0.4]  58.5 21.5 0 top
R36  5.1kΩ  [R_AXIAL-0.4]  94 56.5 180 top
R37  5.1kΩ  [R_AXIAL-0.4]  94 46.5 180 top
R38  5.1kΩ  [R_AXIAL-0.4]  94 36.5 180 top
R39  5.1kΩ  [R_AXIAL-0.4]  94.5 26.5 0 top
R40  1kΩ  [R_AXIAL-0.4]  91.5 41.5 180 top
R41  1kΩ  [R_AXIAL-0.4]  85.5 51 270 top
R42  1kΩ  [R_AXIAL-0.4]  94 51.5 180 top
U1  PIC16F887-I/P  [PDIP-40_L52.3-W13.7-P2.54-LS15.5-BL]  78 88 0 top
U2  CD74HC4051E  [DIP-16_L20.0-W6.4-P2.54-LS7.6-BL]  132 28.5 270 top
U3  MAX232N  [PDIP-16_L19.7-W6.6-P2.54-LS7.8-BL]  21.68 48.35 270 top
U4  PCF8574P  [DIP-16_L19.3-W6.4-P2.54-LS7.6-BL]  77.64 59.64 270 top
U5  PCF8574P  [DIP-16_L19.3-W6.4-P2.54-LS7.6-BL]  77.64 27.64 270 top
U6  Screw Terminal  [CONN-TH_2P-P5.00_DB128V-5.0-2P]  170.5 122.5 270 top
U7  Screw Terminal  [CONN-TH_2P-P5.00_DB128V-5.0-2P]  170.5 112.5 270 top
U8  Screw Terminal  [CONN-TH_2P-P5.00_DB128V-5.0-2P]  170.5 102.5 270 top
U9  Screw Terminal  [CONN-TH_2P-P5.00_DB128V-5.0-2P]  170.5 90.5 270 top
U10  Screw Terminal  [CONN-TH_2P-P5.00_DB128V-5.0-2P]  170.5 80.5 270 top
U11  Screw Terminal  [CONN-TH_2P-P5.00_DB128V-5.0-2P]  170.5 70.5 270 top
U12  Screw Terminal  [CONN-TH_2P-P5.00_DB128V-5.0-2P]  170.5 60.5 270 top
U13  Screw Terminal  [CONN-TH_2P-P5.00_DB128V-5.0-2P]  170.5 49 270 top
U14  Screw Terminal  [CONN-TH_2P-P5.00_DB128V-5.0-2P]  170.5 39 270 top
U15  Screw Terminal  [CONN-TH_2P-P5.00_DB128V-5.0-2P]  170.44 28.98 270 top
U16  Screw Terminal  [CONN-TH_2P-P5.00_DB128V-5.0-2P]  170.44 19.05 270 top
U17  Screw Terminal  [CONN-TH_2P-P5.00_DB128V-5.0-2P]  170.5 7.5 270 top
U18  Screw Terminal  [CONN-TH_2P-P5.00_DB128V-5.0-2P]  170.5 132.5 270 top
U19  CD74HC4051E  [DIP-16_L20.0-W6.4-P2.54-LS7.6-BL]  132 65.5 270 top
U20  TILT1  [CONN-TH_2P-P5.00_DB128V-5.0-2P]  44 59 90 top
U21  TILT2  [CONN-TH_2P-P5.00_DB128V-5.0-2P]  44 49 90 top
U22  ROT1  [CONN-TH_2P-P5.00_DB128V-5.0-2P]  44 39 90 top
U23  ROT2  [CONN-TH_2P-P5.00_DB128V-5.0-2P]  44 29 90 top
U24  ROT3  [CONN-TH_2P-P5.00_DB128V-5.0-2P]  108 69 270 top
U25  ROT4  [CONN-TH_2P-P5.00_DB128V-5.0-2P]  44 19 90 top
U26  Return  [CONN-TH_2P-P5.00_DB128V-5.0-2P]  108 59 270 top
U27  Shift  [CONN-TH_2P-P5.00_DB128V-5.0-2P]  108 49 270 top
U28  Backspace  [CONN-TH_2P-P5.00_DB128V-5.0-2P]  108 39 270 top
U29  Space  [CONN-TH_2P-P5.00_DB128V-5.0-2P]  44 69 90 top
U30  Select  [CONN-TH_2P-P5.00_DB128V-5.0-2P]  108 29 270 top
U31  1000uF 16V  [CAP-TH_BD10.0-P5.00-D0.6-FD]  128 93.5 0 top
U32  1000uF 16V  [CAP-TH_BD10.0-P5.00-D0.6-FD]  14.5 95 0 top
U33  Select  [CONN-TH_2P-P5.00_DB128V-5.0-2P]  60 146.47 0 top
U34  Tilt1  [CONN-TH_2P-P5.00_DB128V-5.0-2P]  50 146.47 0 top
U35  Tilt2  [CONN-TH_2P-P5.00_DB128V-5.0-2P]  40 146.47 0 top
U36  ROT1  [CONN-TH_2P-P5.00_DB128V-5.0-2P]  28.5 146.47 0 top
U37  ROT2  [CONN-TH_2P-P5.00_DB128V-5.0-2P]  18.5 146.47 0 top
U38  ROT3  [CONN-TH_2P-P5.00_DB128V-5.0-2P]  8.5 146.47 0 top
U39  ROT4  [CONN-TH_2P-P5.00_DB128V-5.0-2P]  93.25 146.22 0 top
U40  Return  [CONN-TH_2P-P5.00_DB128V-5.0-2P]  134.25 146.22 0 top
U41  BS  [CONN-TH_2P-P5.00_DB128V-5.0-2P]  124.25 146.22 0 top
U42  Space  [CONN-TH_2P-P5.00_DB128V-5.0-2P]  104.25 146.22 0 top
U43  Spare  [CONN-TH_2P-P5.00_DB128V-5.0-2P]  114.25 146.22 0 top
U44  Shift  [CONN-TH_2P-P5.00_DB128V-5.0-2P]  70 146.47 0 top
U45  Bell  [CONN-TH_2P-P5.00_DB128V-5.0-2P]  83.25 146.22 0 top
U46  PWR  [CONN-TH_2P-P5.00_DB128V-5.0-2P]  153 146 0 top
U47  5v  [CONN-TH_2P-P5.00_DB128V-5.0-2P]  167.5 146 0 top

## Footprints (pads in the part's own frame, mm; a bottom-side part is the same pattern mirrored in y, then rotated)
CAP-TH_BD10.0-P5.00-D0.6-FD
  round 1.6 hole 1: 1(-2.5,0) 2(2.5,0)
CAP-TH_L5.0-W2.5-P5.00-D1.0
  round 1.6 hole 1: 1(-2.5,0) 2(2.5,0)
CONN-TH_2P-P5.00_DB128V-5.0-2P
  round 2.4 hole 1.6: 1(-2.54,0) 2(2.54,0)
DIP-16_L19.3-W6.4-P2.54-LS7.6-BL
  oval 1.46x1.825 hole 0.8: 1(-8.89,-3.81) 2(-6.35,-3.81) 3(-3.81,-3.81) 4(-1.27,-3.81) 5(1.27,-3.81) 6(3.81,-3.81) 7(6.35,-3.81) 8(8.89,-3.81) 9(8.89,3.81) 10(6.35,3.81) 11(3.81,3.81) 12(1.27,3.81) 13(-1.27,3.81) 14(-3.81,3.81) 15(-6.35,3.81) 16(-8.89,3.81)
DIP-16_L20.0-W6.4-P2.54-LS7.6-BL
  round 1.6 hole 1: 1(-8.89,-3.81) 2(-6.35,-3.81) 3(-3.81,-3.81) 4(-1.27,-3.81) 5(1.27,-3.81) 6(3.81,-3.81) 7(6.35,-3.81) 8(8.89,-3.81) 9(8.89,3.81) 10(6.35,3.81) 11(3.81,3.81) 12(1.27,3.81) 13(-1.27,3.81) 14(-3.81,3.81) 15(-6.35,3.81) 16(-8.89,3.81)
DO-41_BD2.4-L4.7-P8.70-D0.9-RD
  round 1.8 hole 1: 1(-4.35,0) 2(4.35,0)
HDR-TH_5P-P2.54-V-F
  rect 1.575x1.575 hole 1.02: 1(-5.08,0)
  round 1.575 hole 1.02: 2(-2.54,0) 3(0,0) 4(2.54,0) 5(5.08,0)
HDR-TH_5P-P2.54-V-M
  rect 1.7x1.7 hole 1.1: 1(-5.08,0)
  round 1.7 hole 1.1: 2(-2.54,0) 3(0,0) 4(2.54,0) 5(5.08,0)
HDR-TH_10P-P2.54-V-M-R2-C5-S2.54
  rect 1.7x1.7 hole 1.1: 1(-5.08,-1.27)
  round 1.7 hole 1.1: 2(-5.08,1.27) 3(-2.54,-1.27) 4(-2.54,1.27) 5(0,-1.27) 6(0,1.27) 7(2.54,-1.27) 8(2.54,1.27) 9(5.08,-1.27) 10(5.08,1.27)
PDIP-16_L19.7-W6.6-P2.54-LS7.8-BL
  rect 1.7x1.7 hole 1: 1(-8.89,-3.9)
  round 1.7 hole 1: 2(-6.35,-3.9) 3(-3.81,-3.9) 4(-1.27,-3.9) 5(1.27,-3.9) 6(3.81,-3.9) 7(6.35,-3.9) 8(8.89,-3.9) 9(8.89,3.9) 10(6.35,3.9) 11(3.81,3.9) 12(1.27,3.9) 13(-1.27,3.9) 14(-3.81,3.9) 15(-6.35,3.9) 16(-8.89,3.9)
PDIP-40_L52.3-W13.7-P2.54-LS15.5-BL
  rect 1.8x1.8 hole 1: 1(-24.13,-7.78)
  round 1.8 hole 1: 2(-21.59,-7.78) 3(-19.05,-7.78) 4(-16.51,-7.78) 5(-13.97,-7.78) 6(-11.43,-7.78) 7(-8.89,-7.78) 8(-6.35,-7.78) 9(-3.81,-7.78) 10(-1.27,-7.78) 11(1.27,-7.78) 12(3.81,-7.78) 13(6.35,-7.78) 14(8.89,-7.78) 15(11.43,-7.78) 16(13.97,-7.78) 17(16.51,-7.78) 18(19.05,-7.78) 19(21.59,-7.78) 20(24.13,-7.78) 21(24.13,7.78) 22(21.59,7.78) 23(19.05,7.78) 24(16.51,7.78) 25(13.97,7.78) 26(11.43,7.78) 27(8.89,7.78) 28(6.35,7.78) 29(3.81,7.78) 30(1.27,7.78) 31(-1.27,7.78) 32(-3.81,7.78) 33(-6.35,7.78) 34(-8.89,7.78) 35(-11.43,7.78) 36(-13.97,7.78) 37(-16.51,7.78) 38(-19.05,7.78) 39(-21.59,7.78) 40(-24.13,7.78)
R_AXIAL-0.4
  round 1.879 hole 0.899: 1(-5.08,0) 2(5.08,0)
TO-220-3_L10.0-W4.5-P2.54-L
  rect 1.8x2.6 hole 1.2: 1(-2.54,0.005)
  oval 1.8x2.6 hole 1.2: 2(0,0.005) 3(2.54,-0.005)

## Nets
As in the schematic.

Pads without a net: U1 8 9 10 17 38

## Via types
v1: diameter 0.61, hole 0.305, Top Layer to Bottom Layer, 10 vias

## Routing (per net, layer and track width the routed paths; a pad name or vN(x,y) marks a point on that pad's centre or on a via; arc(x,y) is an arc through that point)
+5V: length 690
  Top Layer w0.5: R15.2 82.5,43.92 82.5,42.57 C23.2 ; U1.11 77.05,78 49.5,78 C24.2
  Inner1 w0.5: C17.2 23.84,57.24 U3.16 ; H6.1 H6.2 H6.3 H6.4 H6.5 96.98,15 89.42,22.56 ; R35.2 64.64,22.56 89.42,22.56 ; C20.2 138.02,82.02 138.02,106.41 85.59,106.41 85.59,102.4 84.64,101.46 79.6,101.46 74.19,96.05 U1.32 ; 89.42,22.56 R39.1 ; R34.2 86.89,68.53 U4.16 79.27,70.71 U1.11 ; R31.2 57.81,45.73 48.8,45.73 47.77,44.71 29.87,44.71 C14.2 ; R1.2 21.96,17.5 H1.2 ; R33.2 R32.2
  Inner2 w0.5: 29.55,33.53 C14.2 29.55,45.81 24.2,45.81 24.2,55.86 U3.16 ; 29.55,33.53 29.55,21.47 R1.2 ; 29.55,33.53 C15.2 ; 88.16,36.53 88.89,36.53 R38.2 ; 88.16,36.53 89.42,35.26 R39.1 ; 88.16,36.53 U5.16 80.01,37.96 80.01,38.31 ; 151.92,92.15 R20.1 R19.1 R18.1 R17.1 151.92,130 ; 151.92,92.15 R21.1 ; 151.92,92.15 148.15,92.15 C20.2 134.5,75.7 U19.16 150.53,74.39 R22.1 R23.1 R24.1 R25.1 139.92,41.5 U2.16 ; U2.16 146.03,37.39 R26.1 R27.1 151.92,15 ; U2.16 134.5,38.7 C21.2 ; 80.01,38.31 86.38,38.31 86.38,41.4 ; 80.01,38.31 C23.2 ; R32.2 R31.2 R30.2 R29.2 ; 151.92,15 H6.1 ; 151.92,15 R28.1 ; 86.5,41.4 86.38,41.4 ; 86.38,41.4 86.38,43.96 R37.2 R36.2 R34.2 ; U47.2 154.04,130 151.92,130 ; 151.92,130 R16.1 ; 87,45 86.08,45.92 R41.2 ; R35.2 R33.2 ; U4.16 80.14,69.84 C22.2
GND: length 1114.6
  Top Layer w0.5: 22.59,11.41 H1.3 ; 76.05,36.2 U5.2
  Top Layer w2: U28.1 110.5,39.04 110.5,34.85 ; 128.19,61.61 117.93,61.61 U24.1 89.8,71.54 81.81,79.53 U1.12 ; 128.19,61.61 U19.6 ; 128.19,61.61 128.19,61.54 ; H1.3 20.5,11.41 53.87,11.41 58.91,16.46 ; U3.15 39.73,54.7 41.5,56.46 ; C24.1 37.6,83.5 H8.1 33.7,66.46 41.5,66.46 ; U2.8 126.31,17.73 H5.2 H5.4 H5.6 H5.8 H5.10 101.84,17.73 97.34,22.23 97.34,27.57 101.31,31.54 U30.1 110.5,34.04 110.5,34.85 ; U27.1 123.12,51.54 U19.8 ; 65.82,56.46 71.53,50.75 U4.8 ; 65.82,56.46 72.81,63.45 U4.3 ; 65.82,56.46 U20.1 41.5,56.46 ; 41.5,56.46 41.5,66.46 ; 110.5,34.85 U2.2 ; U26.1 128.19,61.54 ; 128.19,61.54 U19.7 ; 58.91,16.46 U25.1 ; 58.91,16.46 71.54,16.46 U5.8 ; U5.2 76.05,33.99 76.05,39.05 C23.1 ; 41.5,66.46 U29.1 ; Q12.3 Q13.3 Q10.3 Q4.3 Q14.3 70.25,121.17 70,121.42 8.5,121.42
  Bottom Layer w0.5: 130.29,63.79 U19.6 ; C15.1 20.5,31.58 ; 130.36,37.02 U2.2 ; 70.98,35.25 72.56,35.25 U5.2
  Bottom Layer w2: U46.1 152.96,148.5 162.46,148.5 U47.1 164.96,135.5 U18.2 173,127.46 173,119.96 ; 46.5,35.25 70.98,35.25 72.25,33.99 U5.2 U5.3 ; 46.5,35.25 45.3,36.46 U22.1 41.5,38.96 41.5,46.46 ; 46.5,35.25 46.5,28.96 U23.1 ; 172.95,16.51 172.95,26.44 ; 172.95,16.51 U16.2 ; 172.95,16.51 172.95,7.41 U17.2 ; 172.95,26.44 172.95,36.46 ; 172.95,26.44 U15.2 ; 172.95,52.21 173,52.27 173,77.96 ; 172.95,52.21 172.95,46.46 ; 172.95,52.21 172.95,57.96 ; 130.29,76.44 130.29,77.71 C20.1 129.5,92.5 U31.2 ; 130.29,76.44 168.99,76.44 U10.2 173,77.96 ; 130.29,76.44 130.29,61.69 U19.6 ; H1.3 20.5,32.96 19.93,33.53 ; Q12.3 Q9.3 169.28,121.17 U6.2 173,119.96 ; C14.1 29.55,51.34 26.19,54.7 U3.15 25,54.7 19.93,49.64 19.93,33.53 ; U7.2 173,112.46 173,119.96 ; C24.1 42.25,90.25 42.25,119.18 40,121.42 ; 41.5,46.46 U21.1 ; 41.5,46.46 41.5,53.96 U20.1 ; 172.95,36.46 172.95,46.46 ; 172.95,36.46 U14.2 ; U2.8 U2.7 U2.6 U2.5 U2.4 ; 14.7,36.11 17.28,33.53 C15.1 19.93,33.53 ; 14.7,36.11 H7.1 ; 14.7,36.11 14.7,44.99 C19.1 ; 172.95,46.46 U13.2 ; 173,77.96 173,87.96 ; U19.7 U19.8 130.36,54.44 130.36,34.85 U2.2 ; U4.3 U4.2 U4.1 73.83,70.9 C22.1 81.81,78.89 U1.12 81.81,88.52 76.73,93.6 U1.31 ; 173,87.96 173,97.46 U8.2 ; 173,87.96 U9.2 ; 172.95,57.96 U12.2 ; 172.95,57.96 172.95,65.51 U11.2 ; U32.2 20.75,98.75 20.75,113.67 28.5,121.42
VCC: length 400.3
  Top Layer w0.5: 54.35,136.03 52.54,137.84
  Top Layer w2: U46.2 147.75,138.22 D8.1 136.79,138.22 ; D6.1 32.85,136.66 31.04,138.47 ; 52.54,138.47 D2.1 ; 52.54,138.47 U34.2 ; 52.54,138.47 52.54,136.03 54.35,136.03 ; 136.79,138.22 U40.2 ; 136.79,138.22 134.47,135.9 128.6,135.9 ; 74.35,136.03 65.85,136.03 ; 74.35,136.03 85.28,136.03 D11.1 ; 74.35,136.03 D10.1 ; 65.85,136.03 54.35,136.03 ; 65.85,136.03 65.85,136.46 D1.1 ; 54.35,136.03 D5.1 ; U38.2 13.55,148.97 18.54,148.97 U37.2 21.04,140.28 D3.1 31.04,138.47 ; D13.1 128.6,135.9 ; 128.6,135.9 118.6,135.9 ; U35.2 40.04,148.97 33.55,148.97 U36.2 31.04,138.47 ; 118.6,135.9 D12.1 118.79,138.22 U41.2 ; 118.6,135.9 110.78,135.9 D9.1
  Bottom Layer w0.5: D9.1 106.79,135.53
  Bottom Layer w2: D2.1 42.54,140.28 U35.2 ; U43.2 116.79,140.03 D12.1 ; U42.2 106.79,138.22 ; 106.79,138.22 106.79,133.78 106.86,133.72 ; 106.79,138.22 D4.1 97.6,144.41 U39.2 93.29,148.72 88.3,148.72 U45.2 85.79,135.53 D11.1 ; U31.1 120.58,93.5 106.86,107.21 106.86,133.72 ; 11.04,133.97 11.04,95.96 U32.1 ; 11.04,133.97 U38.2 ; 11.04,133.97 D7.1 ; U44.2 74.35,144.66 D10.1 ; 106.86,133.72 D9.1 ; D1.1 63.85,145.16 U33.2
$1N2074: length 134.5
  Top Layer w0.5: U2.3 128.38,32.5 129.5,32.5 132.5,35.5 132.5,43 143.5,54 143.5,75 133,85.5 121.5,85.5 106,101 98.5,101 96,98.5 74.37,98.5 U1.33
$1N3237: length 33.4
  Inner2 w0.5: C16.2 20.4,30.18 20.4,57.24 U3.1
$1N3246: length 25.9
  Inner2 w0.5: U3.3 16.4,50.78 16.4,29.18 C16.1
$1N3251: length 5.3
  Inner1 w0.5: C18.2 14.46,49.62 U3.4
$1N3254: length 15.6
  Inner2 w0.5: C18.1 13.11,55.97 19.18,55.97 19.18,48.48 U3.5
$1N3731: length 32.2
  Bottom Layer w0.5: 60.14,123.97 56.56,127.55
  Bottom Layer w2: U33.1 55.15,144.16 D1.2 56.56,137.06 56.56,125.44 58.03,123.97 Q1.2
$1N3765: length 29.9
  Bottom Layer w0.5: 39.64,123.97 37.46,126.14
  Bottom Layer w2: 37.46,138.47 37.46,123.97 Q2.2 ; 37.46,138.47 U35.1 ; 37.46,138.47 D2.2
$1N3801: length 31.4
  Bottom Layer w0.5: 15.16,126.95 18.14,123.97
  Bottom Layer w2: D3.2 15.16,138.47 ; 15.16,138.47 15.96,139.27 U37.1 ; 15.16,138.47 15.16,123.97 Q3.2
$1N3842: length 36.9
  Top Layer w0.5: 90.71,125.89 92.89,123.72
  Top Layer w2: U39.1 90.71,123.72 Q4.2
  Bottom Layer w2: U39.1 88.9,144.41 D4.2
$1N3888: length 31.9
  Top Layer w0.5: 45.65,127.95 49.64,123.97
  Top Layer w2: Q8.2 48.03,123.97 45.65,126.35 D5.2
  Bottom Layer w2: U34.1 47.46,135.78 D5.2
$1N3934: length 30
  Bottom Layer w0.5: 25.9,126.2 28.14,123.97
  Bottom Layer w2: Q7.2 25.9,123.97 25.9,133.97 ; 25.9,133.97 25.96,134.02 U36.1 ; 25.9,133.97 D6.2
$1N3992: length 30
  Bottom Layer w0.5: 5.9,126.2 8.14,123.97
  Bottom Layer w2: D7.2 5.9,133.97 ; 5.9,133.97 5.9,123.97 Q6.2 ; 5.9,133.97 5.96,134.02 U38.1
$1N4173: length 30.7
  Bottom Layer w0.5: 130.81,126.8 133.89,123.72
  Bottom Layer w2: D8.2 130.81,138.22 ; 130.81,138.22 131.71,139.12 U40.1 ; 130.81,138.22 130.81,125.19 132.28,123.72 Q9.2
$1N4211: length 68.3
  Top Layer w0.5: 119.9,127.7 123.89,123.72
  Top Layer w2: 119.9,131.05 107.81,131.05 104.29,134.57 104.29,148.72 119.21,148.72 U41.1 ; 119.9,131.05 D13.2 ; 119.9,131.05 119.9,126.1 122.28,123.72 Q12.2
$1N4247: length 30
  Top Layer w0.5: 101.65,125.95 103.89,123.72
  Top Layer w2: D9.2 101.65,133.72 ; 101.65,133.72 101.65,123.72 Q10.2 ; 101.65,133.72 101.71,133.77 U42.1
$1N4285: length 29.9
  Bottom Layer w0.5: 111.71,125.89 113.89,123.72
  Bottom Layer w2: U43.1 111.71,138.22 ; 111.71,138.22 111.71,123.72 Q13.2 ; 111.71,138.22 D12.2
$1N4325: length 30
  Bottom Layer w0.5: 67.4,126.2 69.64,123.97
  Bottom Layer w2: 67.4,133.97 67.46,134.02 U44.1 ; 67.4,133.97 D10.2 ; 67.4,133.97 67.4,123.97 Q11.2
$1N4367: length 31.9
  Bottom Layer w0.5: 82.89,123.72 78.9,127.7
  Bottom Layer w2: U45.1 78.9,144.41 D11.2 78.9,126.1 81.28,123.72 Q14.2
$1N5558: length 234.1
  Inner2 w0.5: U1.1 64.59,90.94 99.77,90.94 104.39,95.55 104.39,96.01 102.92,97.48 97.8,97.48 96.61,98.67 50.25,98.67 50.25,19.6 42.81,12.16 16.76,12.16 H1.1 R1.1
$1N5572: length 123.8
  Inner1 w0.5: v1(17.17,90.85) 48.94,90.85 U1.40
  Inner2 w0.5: H1.4 17.57,18.97 17.15,18.97 11.15,24.98 11.15,84.82 v1(17.17,90.85)
$1N5582: length 178.4
  Inner1 w0.5: H1.5 33.08,21 33.08,28.88 16.72,28.88 16.72,28.05 15.89,27.22 11.44,27.22 7.01,31.66 7.01,105.45 8.06,106.51 50.44,106.51 56.41,100.54 U1.39
$1N6750: length 6.2
  Inner1 w0.5: U3.6 15.05,44.54 C19.2
$1N6798: length 8.9
  Inner1 w0.5: U3.2 14.05,58.43 C17.1
$1N7931: length 117.6
  Inner1 w0.5: U1.26 81,87.35 v1(26.67,87.35)
  Inner2 w0.5: v1(26.67,87.35) 24.59,85.27 24.59,74.43 ; 24.59,74.43 H8.2 ; 24.59,74.43 28.14,74.43 30.9,71.66 30.9,49.08 28.9,47.08 U3.12
$1N7983: length 111.4
  Inner1 w0.5: H8.3 33.87,84.85 81.04,84.85 U1.25
  Inner2 w0.5: H8.3 22.36,73.03 22.36,44.54 U3.11
$1N8002: length 206.1
  Inner2 w0.5: U1.16 100.58,88.83 117.35,88.83 117.35,106.3 73.07,106.3 71.42,104.64 71.42,102.99 63.43,102.99 62,104.42 62,105.86 54.03,105.86 50.44,102.26 35.5,102.26 19.51,86.27 H8.4 20.4,72.14 20.4,60.03 21.71,58.73 21.71,43.33 U3.9
$1N8069: length 122.4
  Inner1 w0.5: 28.53,58.39 28.53,61.47 H8.5 ; 28.53,58.39 52.78,58.39 54.06,57.1 74.91,57.1 76.1,58.29 76.1,60.45 80.37,64.72 90.41,64.72 90.41,79.24 U1.15 ; 28.53,58.39 28.53,57.79 26.71,55.97 24.2,55.97 24.2,43.38 U3.10
$1N8133: length 34.7
  Inner1 w0.5: U3.14 27.79,49.95 27.79,35.47 23.35,31.03 H7.3
$1N8212: length 28.6
  Inner1 w0.5: U3.13 26.98,48.21 26.98,40.73 16.67,40.73 14.61,38.66 14.61,35.63 H7.2
$1N8218: length 14
  Top Layer w0.5: H7.4 12.56,28.5 14,28.5 16.5,31 16.5,37.5 17.78,38.78 U3.8
$1N8222: length 23.5
  Inner2 w0.5: U3.7 19.75,40.03 19.75,26.93 18.77,25.95 H7.5
$1N13570: length 16.7
  Bottom Layer w2: R2.1 97.6,118.14 97.6,123.01 94.35,126.25 Q4.1
$1N13571: length 96.7
  Inner2 w0.5: R2.2 94.61,104.99 114.96,104.99 115.9,104.05 115.9,97.64 108.54,90.28 66.47,90.28 U1.2
$1N13601: length 15.6
  Inner2 w0.5: R3.1 14.31,118.74 14.31,122.65 18.16,126.5 Q3.1
$1N13602: length 202.6
  Inner2 w0.5: R3.2 23.68,109.56 121.77,109.56 121.77,76.68 62.49,76.68 U1.3
$1N13633: length 311.9
  Top Layer w2: Q2.1 40.01,139.31 45,144.31 45,147.86 48.16,151.02 163.79,151.02 167.46,147.35 167.46,117.07 161.88,111.49 129.37,111.49 124.09,116.77 42.22,116.77 R4.1
$1N13634: length 204.4
  Inner2 w0.5: U1.4 64.38,77.33 121.11,77.33 121.11,108.91 29.93,108.91 27.01,105.99 27.01,102.92 38.53,102.92 R4.2
$1N13665: length 34.1
  Top Layer w2: v1(54.37,126.06) 54.37,126.17 60.23,126.17 60.51,126.45
  Inner1 w0.5: Q1.1 60.85,126.5 62.34,125.02 62.34,116.38 R5.1
  Bottom Layer w2: R5.1 54.37,120.67 v1(54.37,126.06)
$1N13666: length 131.8
  Inner2 w0.5: R5.2 62.62,102.26 72.15,102.26 72.15,103.95 73.84,105.65 116.55,105.65 116.55,89.63 73.44,89.63 U1.5
$1N13721: length 64.7
  Bottom Layer w2: R6.1 1.85,121.2 1.85,146.21 4.61,148.97 8.51,148.97 Q6.1
$1N13722: length 225.5
  Inner1 w0.5: U1.6 72.42,74.37 76.49,74.37 78.28,72.58 v1(78.28,71.22)
  Inner2 w0.5: v1(78.28,71.22) 77.93,70.87 71.68,70.87 65.07,64.26 65.07,20.43 56,11.36 15.28,11.36 8.5,18.14 R6.2
$1N13752: length 18.8
  Bottom Layer w0.5: 31.09,124.27 28.85,126.5
  Bottom Layer w2: Q7.1 31.09,126.5 31.09,117.13 R7.2
$1N13753: length 177.4
  Inner2 w0.5: R7.1 32.37,108.25 120.46,108.25 120.46,77.98 69.11,77.98 U1.7
$1N13784: length 59.6
  Top Layer w0.5: 52.1,128.6 v1(61.46,128.6)
  Top Layer w2: v1(61.46,128.6) 61.46,128.81 52.31,128.81 52.1,128.6 Q8.1
  Bottom Layer w0.5: 60.76,112.24 63.09,114.57 ; 63.09,126.97 v1(61.46,128.6)
  Bottom Layer w2: R8.1 52.31,112.24 63.09,112.24 63.09,128.6 v1(61.46,128.6)
$1N13785: length 132
  Inner2 w0.5: R8.2 53.22,107.6 118.66,107.6 118.66,78.79 86.89,78.79 U1.14
$1N13840: length 19.8
  Bottom Layer w0.5: 121.67,124.01 123.91,126.25
  Bottom Layer w2: R9.1 121.67,115.88 121.67,126.25 Q12.1
$1N13841: length 44.4
  Inner1 w0.5: U1.27 86.89,99.83 92.16,105.11 122.28,105.11 R9.2
$1N13874: length 16.5
  Bottom Layer w2: R10.1 117.7,116.74 117.7,123.91 115.35,126.25 Q13.1
$1N13875: length 18.7
  Inner1 w0.5: U1.22 99.59,97.53 v1(100.39,98.34)
  Inner2 w0.5: v1(100.39,98.34) 109.45,98.34 R10.2
$1N13908: length 166.5
  Top Layer w2: Q14.1 80.91,128.6 v1(73.45,128.6) ; v1(35.17,113.85) 38.02,111 v1(80,111)
  Bottom Layer w2: v1(80,111) 82.75,113.75 R11.2 ; v1(35.17,113.85) 35.17,128.88 28.54,128.88 28.54,148.97 69.97,148.97 69.97,131.66 70.39,131.66 v1(73.45,128.6)
$1N13941: length 40.3
  Bottom Layer w2: R12.1 99.9,117.65 99.9,122.99 103.16,126.25 Q10.1 99.4,131.11 83.22,131.11
$1N13942: length 35.9
  Inner1 w0.5: R12.2 104.25,92.1 94.3,82.15 86.28,82.15 U1.13
$1N13975: length 18.1
  Bottom Layer w2: Q11.1 71.1,126.5 76.6,121.01 70.14,114.55 R13.1
$1N13976: length 94.2
  Inner2 w0.5: U1.19 99.59,82.82 118.01,82.82 118.01,106.95 72.52,106.95 70,104.43 R13.2
$1N14008: length 15.8
  Top Layer w2: R14.1 137.72,116.76 137.72,123.89 135.35,126.25 Q9.1
$1N14009: length 47.1
  Inner1 w0.5: U1.20 119.52,80.22 134.75,95.45 R14.2
$1N14186: length 142.5
  Inner1 w0.5: U4.15 77.3,70.14 77.3,72.36 76.09,73.56 58.02,73.56 52.42,79.17 52.42,81.27 55.19,84.04 85.31,84.04 U1.23
  Inner2 w0.5: U5.15 80.43,33.99 77.63,36.8 77.63,62.17 U4.15
  Bottom Layer w0.5: R40.1 94.58,39.5 87,39.5 81.49,33.99 U5.15
$1N14193: length 101.4
  Inner1 w0.5: U1.18 97.05,63.45 U4.14
  Inner2 w0.5: U5.14 76.82,36.07 76.82,64.21 79.87,67.26 82.92,67.26 82.92,64.92 U4.14
  Bottom Layer w0.5: U4.14 86.55,63.45 98.5,51.5 R42.1
$1N14202: length 156.7
  Inner2 w0.5: U1.24 92.43,97.86 50.94,97.86 50.94,74.26 80.39,74.26 83.72,70.93 83.72,63.18 U4.13 ; U4.13 78.68,58.14 78.68,36.95 80.34,35.29 82.92,35.29 82.92,30.37 U5.13 ; U4.13 85.5,56.86 R41.1
$1N14385: length 8.2
  Inner2 w0.5: U5.1 73.5,36.86 73.5,43.1 72.6,44 R15.1
$1N16045: length 158
  Inner1 w0.5: U19.3 126.56,70.94 126.56,75.68 133.98,75.68 138.68,80.37 138.68,107.06 82.75,107.06 R11.1 77.47,104.14 U1.34
  Inner2 w0.5: U1.34 70.54,94.35 100.7,94.35 U1.21
$1N16121: length 121.7
  Inner2 w0.5: U19.11 133.02,64.48 133.02,75.44 132.52,75.94 132.52,76.13 132.08,76.57 122.69,76.57 122.42,76.3 122.42,76.03 55.56,76.03 52.49,79.09 52.49,84.29 60.75,92.54 63.33,92.54 U1.35
$1N16130: length 262.3
  Inner1 w0.5: U19.10 136.37,59.71 171.49,59.71 173.69,61.92 173.69,134.95 171.85,136.79 66,136.79 64.03,134.83 U1.36
$1N16148: length 377.5
  Inner1 w0.5: U1.37 61.49,100.78 57.21,105.05 57.21,105.11 55.02,107.31 7.66,107.31 6.2,105.86 6.2,20.43 18.11,8.53 153.41,8.53 153.41,22.57 150.02,25.96 126.86,25.96 126.86,47.66 U19.9
$1N16157: length 157.5
  Inner1 w0.5: U2.11 134.54,23.42 127.18,23.42 125.9,24.7 125.9,77.18 128.94,80.22 131.64,80.22 137.37,85.95 137.37,103.58 135.19,105.76 88.71,105.76 86.24,103.28 86.24,101.75 84.35,99.86 U1.28
$1N16164: length 187.4
  Inner2 w0.5: U1.29 80.38,97.21 52.82,97.21 51.76,96.16 51.76,75.38 123.07,75.38 123.07,75.57 123.27,75.77 131.5,75.77 131.87,75.4 131.87,75.04 132.12,75.04 132.37,74.79 132.37,25.59 U2.10
$1N16178: length 262.9
  Inner1 w0.5: U2.9 129.7,13.5 43.85,13.5 41.44,15.91 41.44,29.76 11.15,29.76 11.15,73.14 27.86,89.86 73.35,89.86 U1.30
$1N17408: length 39.7
  Inner1 w0.5: H5.1 112.58,24.99 108.29,29.27 86.62,29.27 86.62,27.82 85.17,26.37 U5.12
$1N17413: length 37.7
  Inner1 w0.5: U5.11 87.93,23.83 87.93,27.97 93.58,27.97 98.07,23.49 98.07,22.25 101.31,19 108.77,19 H5.3
$1N17418: length 27.3
  Inner2 w0.5: H5.5 105.45,22.32 82.48,22.32 U5.10
$1N17423: length 25.3
  Inner2 w0.5: H5.7 103.56,21.67 93.04,21.67 90.12,18.75 U5.9
$1N17428: length 31.3
  Inner2 w0.5: U5.7 76.56,21.29 80.38,17.46 98.33,17.46 101.14,20.27 H5.9
$1N17969: length 34.2
  Inner1 w0.5: U4.4 70.02,64.72 60.2,64.72 R29.1 53.38,71.54 U29.2
$1N17976: length 31.1
  Inner1 w0.5: U20.2 53.38,61.54 R30.1 56.55,58.37 U4.5
$1N17983: length 31.6
  Inner1 w0.5: U4.6 57.71,55.83 53.42,51.54 ; 53.42,51.54 R31.1 ; 53.42,51.54 U21.2
$1N17990: length 37.9
  Inner1 w0.5: 50.24,41.54 53.38,41.54 R32.1 ; 50.24,41.54 53.12,44.43 60.64,44.43 69.51,53.29 U4.7 ; 50.24,41.54 U22.2
$1N17997: length 46.5
  Inner1 w0.5: U4.9 77.64,46.94 66.46,46.94 53.42,33.9 R33.1 52.96,31.54 U23.2
$1N18006: length 42.8
  Inner1 w0.5: U24.2 107.96,66.5 R34.1 99.08,62.18 80.37,62.18 78.52,60.33 78.52,56.22 U4.10
$1N18015: length 78.1
  Inner1 w0.5: U4.11 83.27,54.01 83.27,52.02 69.85,52.02 56.04,38.21 42.25,38.21 42.25,23.29 U25.2 53.38,21.54 R35.1
$1N18024: length 27.3
  Inner1 w0.5: U26.2 99.12,56.46 R36.1 97.21,58.37 U4.12
$1N18172: length 64.2
  Inner1 w0.5: U5.4 75.09,27.65 84.68,27.65 85.82,28.79 85.82,29.93 109.75,29.93 109.75,44.71 U27.2 99.12,46.46 R37.1
$1N18208: length 51.3
  Inner1 w0.5: R38.1 99.12,36.46 106.25,36.46 ; 106.25,36.46 102.5,32.72 72.36,32.72 72.36,27.83 U5.5 ; 106.25,36.46 U28.2
$1N18215: length 39.1
  Inner1 w0.5: U30.2 99.62,26.46 R39.2 97.46,28.62 87.27,28.62 87.27,25.08 75.09,25.08 U5.6
$1N20388: length 46
  Inner1 w0.5: U2.12 151.98,27.23 162.08,17.13 162.08,10.02 ; U17.1 162.1,10.04 162.08,10.02 ; 162.08,10.02 R28.2
$1N20399: length 38.1
  Inner1 w0.5: U16.1 170.35,21.5 R27.2 154.46,29.12 136.46,29.12 U2.13
$1N20410: length 36.4
  Inner1 w0.5: U2.14 142.53,32.31 145.06,29.77 160.35,29.77 R26.2 170.42,31.5 U15.1
$1N20421: length 37.5
  Inner1 w0.5: U14.1 162.12,41.54 R25.2 155.43,34.85 U2.15
$1N20432: length 50.8
  Inner1 w0.5: U2.1 130.45,39.65 154.66,39.65 162.08,47.07 R24.2 162.12,51.54 U13.1
$1N20451: length 35.4
  Inner1 w0.5: 162.08,63.04 U12.1 ; 162.08,63.04 160.65,64.47 136.05,64.47 U19.12 ; 162.08,63.04 R23.2
$1N20462: length 43.3
  Inner1 w0.5: R22.2 162.12,73.04 168.09,73.04 ; 168.09,73.04 U11.1 ; 168.09,73.04 161.82,66.77 U19.13
$1N20473: length 41.8
  Inner1 w0.5: U19.14 150.79,69.31 162.08,80.6 R21.2 162.12,83.04 U10.1
$1N20484: length 43.5
  Inner1 w0.5: U9.1 170.46,93 R20.2 159.14,93 137.99,71.85 U19.15
$1N20503: length 279.3
  Inner1 w0.5: R19.2 170.46,105 U8.1
  Inner2 w0.5: U19.1 131.71,70.87 131.71,20.88 137.16,20.88 137.16,33.58 134.8,33.58 133.17,35.21 133.17,53.19 135.24,55.26 137.16,55.26 137.16,68.04 134.8,68.04 133.67,69.17 133.67,76.35 133.42,76.35 133.17,76.6 133.17,114.77 138.12,119.72 140.94,119.72 148.71,127.49 148.71,147.75 171.39,147.75 172.25,146.89 172.25,106.79 U8.1
$1N20518: length 69.9
  Inner1 w0.5: U7.1 162.12,115.04 R18.2 154.28,107.2 154.28,90.56 136.84,73.12 129.46,73.12 U19.2
$1N20533: length 112.6
  Inner1 w0.5: 170.5,125.02 U6.1 ; 170.5,125.02 170.48,125 R17.2 ; 170.5,125.02 172.24,123.28 172.24,66.59 171.15,65.5 129.46,65.5 U19.4
$1N20548: length 129.1
  Inner1 w0.5: R16.2 162.12,135.04 U18.1 173.04,132.5 173.04,62.48 171.85,61.29 150.43,61.29 150.43,62.12 149.59,62.96 129.46,62.96 U19.5

## Text on the board
Top Silkscreen Layer: Program | Expansion | 12v | 5v | RS232 | TTL
